# EasyEDA Pro project pcb.epro, board PCB17_1
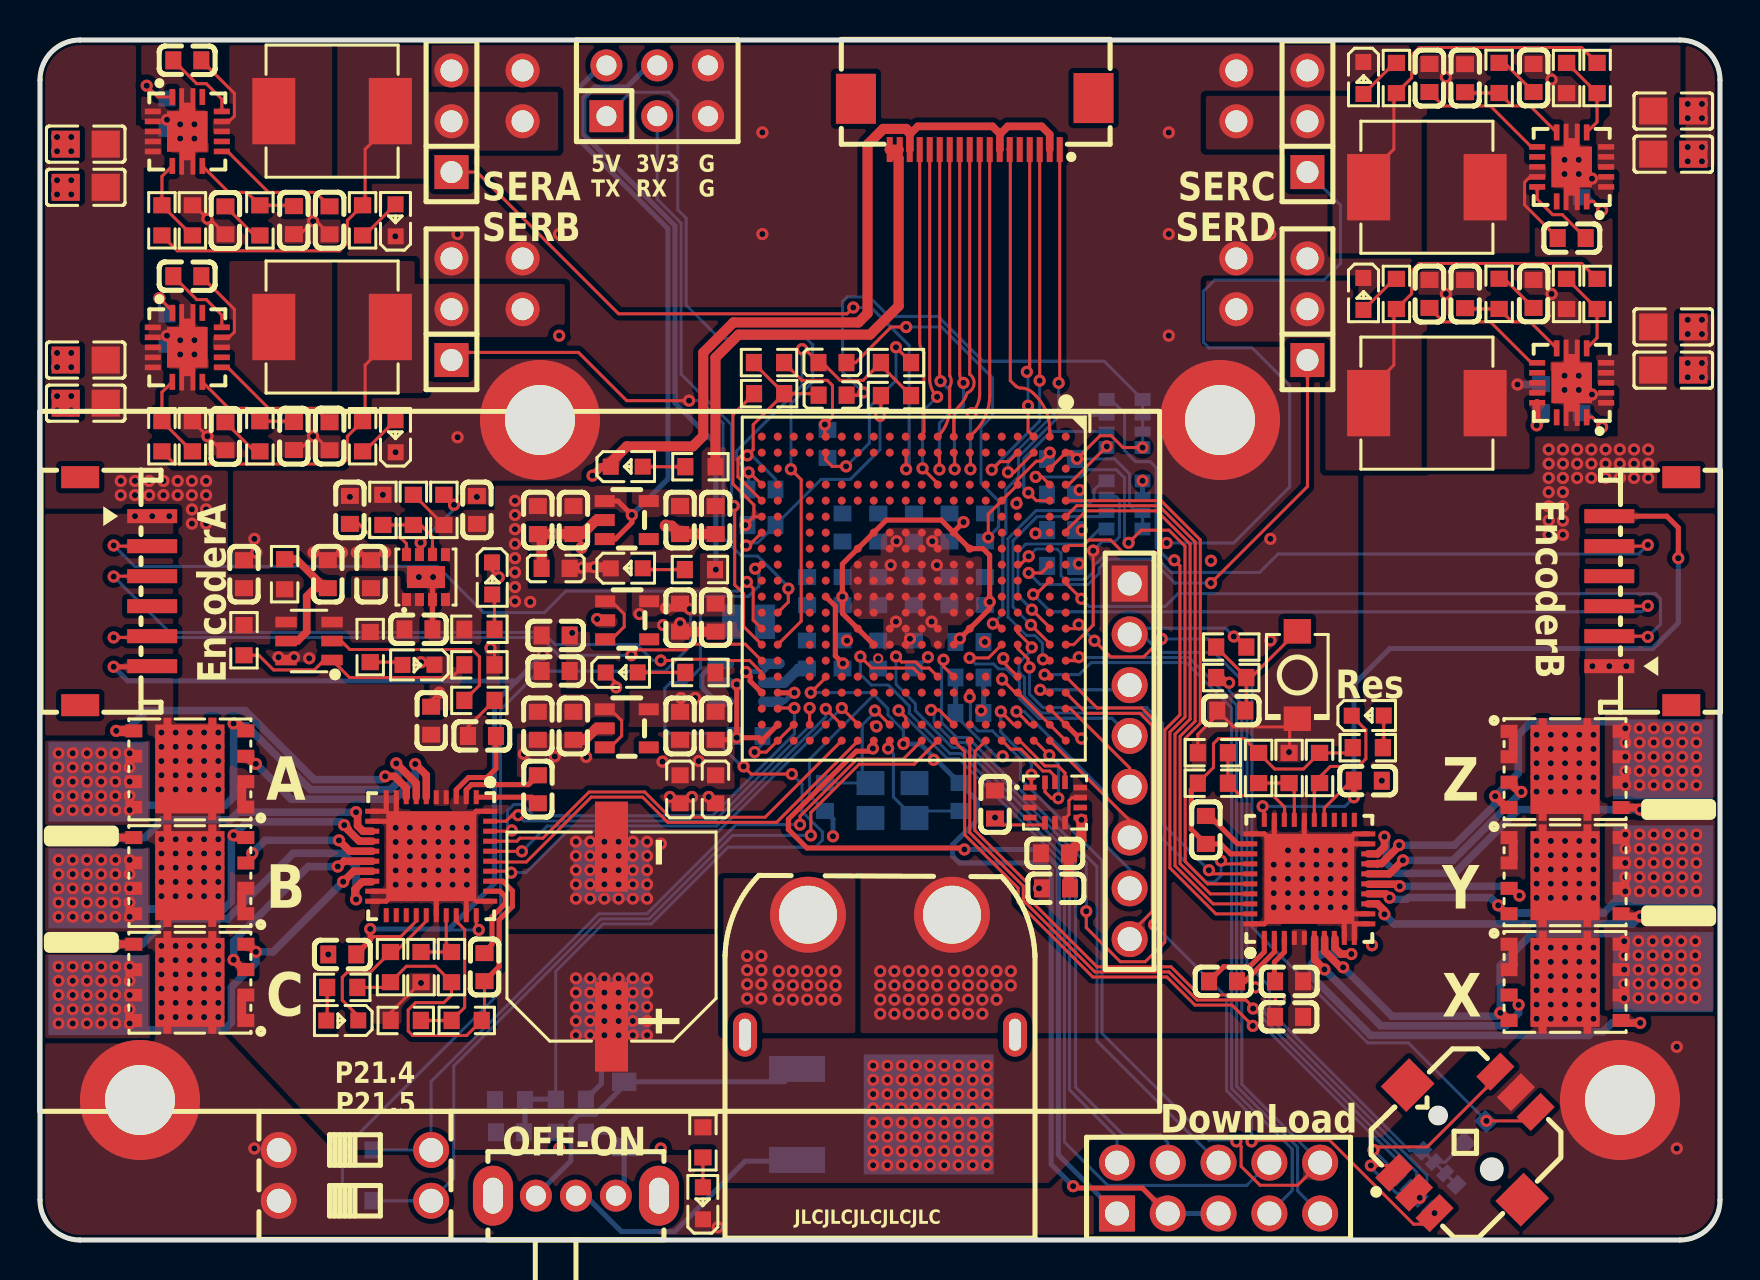
[diagram p5: board, top side]
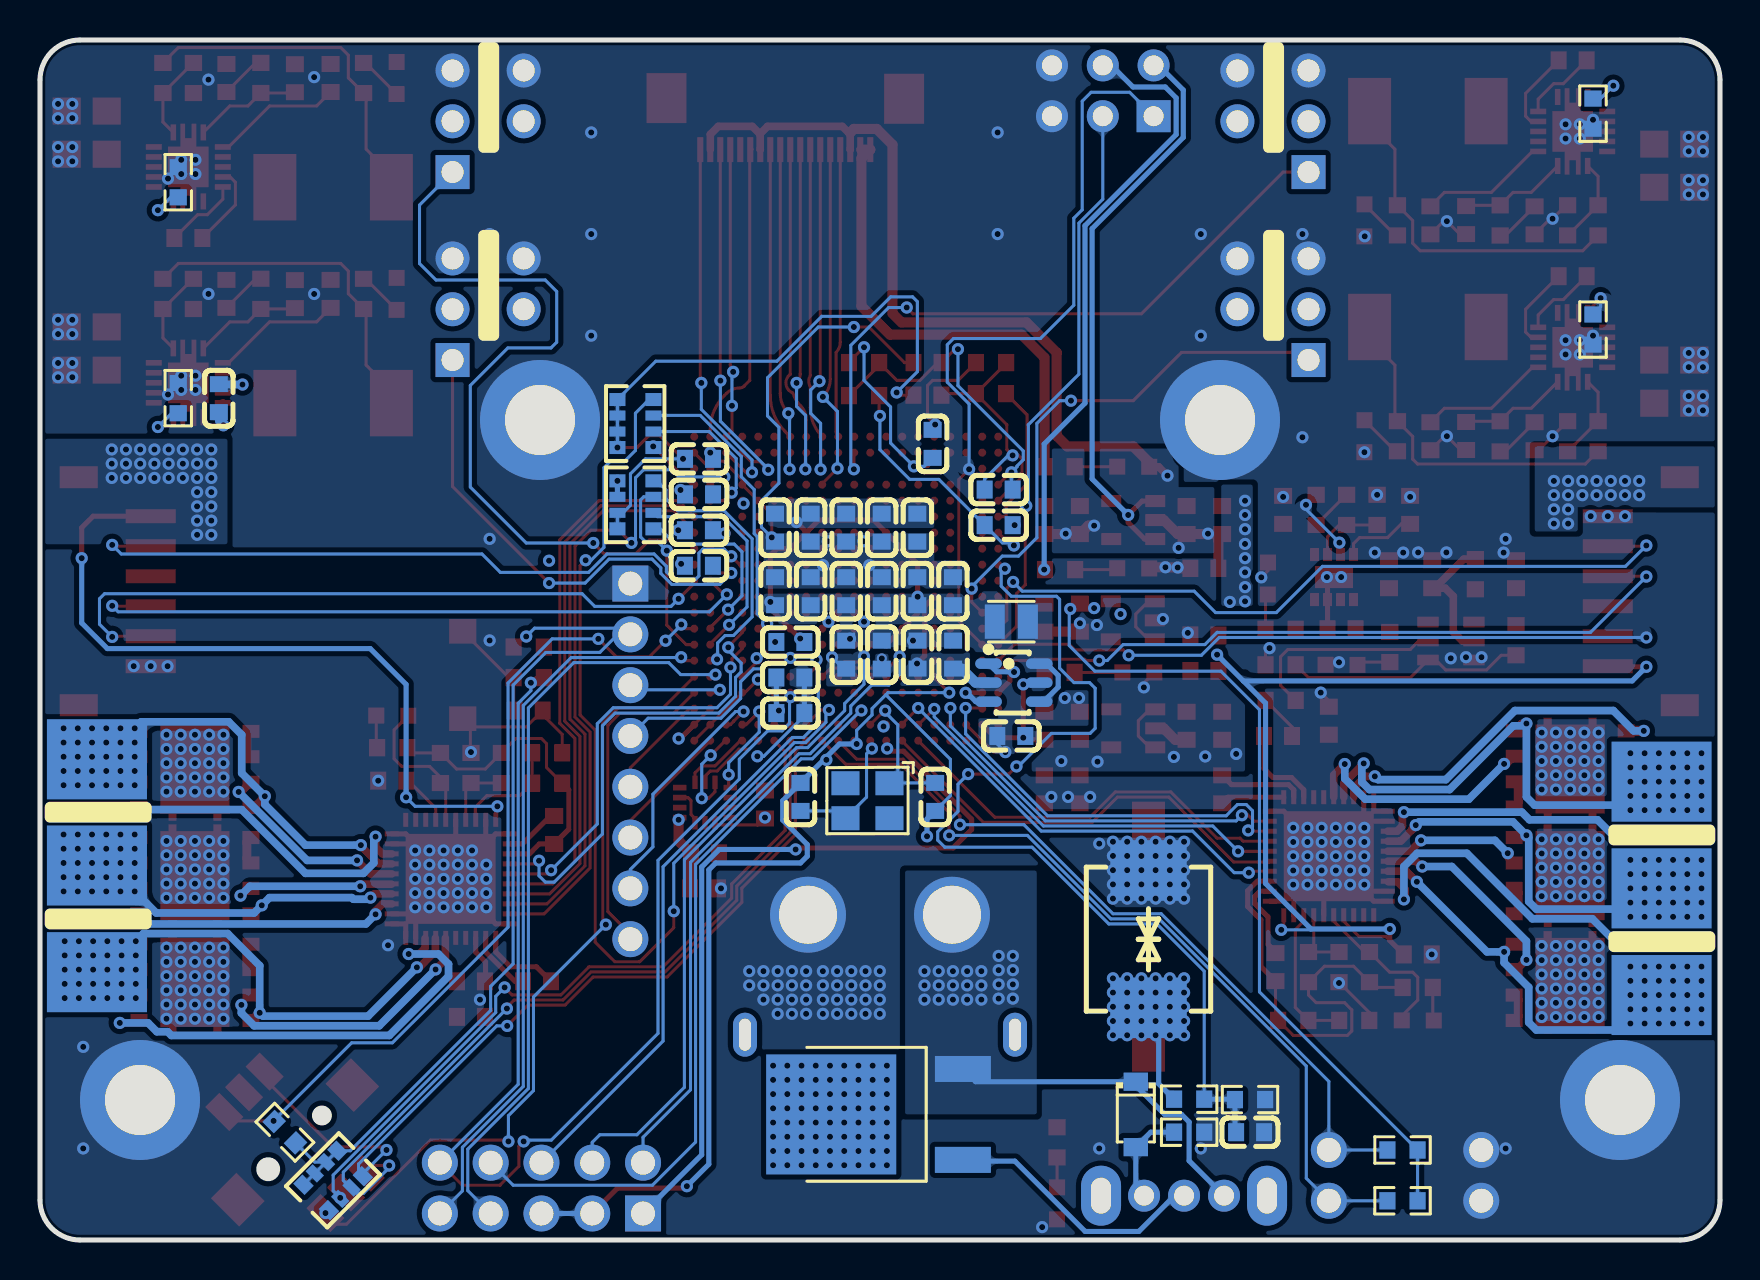
[diagram p6: board, bottom side, seen from below]

Outline 84 x 60 mm; copper layers: Top Layer, Inner1, Inner2, Bottom Layer. Coordinates in mm from the lower left corner of the outline.
Outline path: 0,58 0,2 arc(0.59,0.59) 2,0 82,0 arc(83.41,0.59) 84,2 84,58 arc(83.41,59.41) 82,60 2,60 arc(0.59,59.41) 0,58
Stack: Top Layer 0.035mm 外层铜厚1oz / Dielectric1 0.2104mm 7628 RC49% 8.6mil / Inner1 0.0152mm 内层铜厚 / Dielectric2 1.065mm 1.1mm H/HOZ Copper / Inner2 0.0152mm 内层铜厚 / Dielectric3 0.2104mm 7628 RC49% 8.6mil / Bottom Layer 0.035mm 外层铜厚1oz

## Design rules (mm)
net TMS: DP1
net TCK: DP1
template: 自定义配置
spacing copperThickness1oz (default): track to track 0.102, other pairs 0.152 to 0.3
spacing copperThickness2oz: track to track 0.203, other pairs 0.152 to 0.3
track width copperThickness1oz (default): min 0.127, default 0.254, max 2.54
track width copperThickness2oz: min 0.203, default 0.254, max 2.54
differential pair differentialPair (default): width min 0.127, default 0.254, max 2.54; gap min 0.152, default 0.152
via viaSize (default): diameter min 0.5, default 0.61, max 10; hole min 0.3, default 0.305, max 6.3

## Placement (name value [footprint] x y rotation side)
C1  100nF  [C0603]  40.12 29.27 90 bottom
C2  100nF  [C0603]  43.69 29.27 90 bottom
C3  100nF  [C0603]  38.34 29.27 90 bottom
C4  100nF  [C0603]  51.05 39.06 180 bottom
C5  100nF  [C0603]  51.05 37.28 180 bottom
C6  100nF  [C0603]  51.05 35.49 180 bottom
C7  100nF  [C0603]  41.91 29.27 90 bottom
C8  100nF  [C0603]  51.05 33.71 180 bottom
C9  2.2uF  [C0603]  46.48 26.34 180 bottom
C10  47uF  [C0603]  46.48 28.12 180 bottom
C11  100nF  [C0603]  59.56 26.47 0 top
C12  100nF  [C0603]  40.13 32.44 90 bottom
C13  100nF  [C0603]  41.91 32.44 90 bottom
C14  100nF  [C0603]  43.69 32.44 90 bottom
C15  100nF  [C0603]  45.47 32.44 90 bottom
C16  100nF  [C0603]  47.24 32.44 90 bottom
C17  22uF  [C0603]  35.43 25.2 0 bottom
C18  22uF  [C0603]  38.35 32.44 270 bottom
C19  100nF  [C0603]  46.48 29.9 0 bottom
C20  100nF  [C0603]  47.25 35.62 270 bottom
C21  15pF  [C0603]  45.97 22.15 270 bottom
C22  100nF  [C0603]  45.47 35.62 270 bottom
C23  100nF  [C0603]  43.69 35.62 270 bottom
C24  100nF  [C0603]  41.91 35.62 270 bottom
C25  100nF  [C0603]  40.13 35.62 270 bottom
C26  15pF  [C0603]  39.24 22.15 90 bottom
C27  100nF  [C0603]  36.07 37.52 180 bottom
C28  100nF  [C0603]  36.07 35.74 0 bottom
C29  100nF  [C0603]  39.37 39.81 270 bottom
C30  1uF  [C0603]  24.89 25.71 90 top
C31  100nF  [C0603]  26.67 25.71 90 top
C32  100nF  [C0603]  32 25.71 90 top
C33  1uF  [C0603]  33.78 25.71 90 top
C34  3.3nF  [C0603]  15.49 36.5 90 top
C35  1uF  [C0603]  25.78 28.45 180 top
C36  100nF  [C0603]  25.78 30.23 180 top
C37  1uF  [C0603]  24.89 36 90 top
C38  100nF  [C0603]  26.67 36 90 top
C39  100nF  [C0603]  32 31.12 90 top
C40  1uF  [C0603]  33.78 31.12 90 top
C41  100nF  [C0603]  32 36 90 top
C42  1uF  [C0603]  33.78 36 90 top
C43  10uF  [C0603]  18.92 30.54 180 top
C44  22uF  [C0603]  21.84 36.5 270 top
C45  470uF  [CAP-SMD_BD10.0-L10.3-W10.3-LS11.3-FD]  28.57 15.17 90 top
C46  1uF  [C0603]  16.55 33.29 270 top
C47  10uF  [C0603]  10.2 33.29 270 top
C48  1uF  [C0603]  14.39 33.29 270 top
C49  100nF  [C0603]  23.5 5.39 180 bottom
C50  10nF  [C0603]  47.75 21.77 270 top
C51  2.2uF  [C0603]  50.8 17.58 0 top
C52  100nF  [C0603]  50.75 19.33 0 top
C53  47nF  [C0603]  24.89 22.53 270 top
C54  47nF  [C0603]  59.15 12.93 180 top
C55  1uF  [C0603]  22.1 25.2 0 top
C56  1uF  [C0603]  62.45 12.93 180 top
C57  100nF  [C0603]  19.56 25.96 270 top
C58  100nF  [C0603]  62.45 11.16 0 top
C59  100nF  [C0603]  22.22 13.64 270 top
C60  100nF  [C0603]  58.29 20.5 270 top
C61  1uF  [C0603]  15.11 14.28 180 top
C62  1uF  [C0603]  66.39 22.97 0 top
C63  100nF  [C0603]  7.37 58.98 0 top
C64  100nF  [C0603]  7.37 48.19 0 top
C65  10uF  [C0805]  2.29 52.63 180 top
C66  10uF  [C0805]  2.29 41.84 180 top
C67  4.7uF  [C0805]  2.29 54.79 0 top
C68  22nF  [C0603]  14.48 50.98 270 top
C69  4.7uF  [C0805]  2.29 44 0 top
C70  22nF  [C0603]  14.48 40.19 270 top
C71  10pF  [C0603]  12.69 50.99 90 top
C72  10pF  [C0603]  12.69 40.2 90 top
C73  10nF  [C0603]  9.27 50.98 90 top
C74  10nF  [C0603]  9.27 40.19 90 top
C75  100nF  [C0603]  76.58 50.1 180 top
C76  100nF  [C0603]  75.06 42.09 90 bottom
C77  10uF  [C0805]  81.66 56.45 0 top
C78  10uF  [C0805]  81.66 45.65 0 top
C79  4.7uF  [C0805]  81.66 54.29 180 top
C80  22nF  [C0603]  69.47 58.1 90 top
C81  4.7uF  [C0805]  81.66 43.49 180 top
C82  22nF  [C0603]  69.47 47.3 90 top
C83  10pF  [C0603]  71.25 58.09 270 top
C84  10pF  [C0603]  71.25 47.29 270 top
C85  10nF  [C0603]  74.68 58.1 270 top
C86  10nF  [C0603]  74.68 47.3 270 top
CN1  XT60PW-M  [CONN-TH_XT60PW-M]  42 13.26 90 top
CN2  HX15001-6AWB  [CONN-SMD_HX15001-6AWB]  3.81 32.44 270 top
CN3  HX15001-6AWB  [CONN-SMD_HX15001-6AWB]  80.26 32.44 90 top
D1  BZT52C16  [SOD-123_L2.7-W1.6-LS3.7-RD]  29.21 6.28 270 bottom
D3  SMDJ15CA  [SMC_L6.9-W5.9-LS7.9-BI]  28.57 15.04 270 bottom
FPC1  FPC-05F-18PH20  [FPC-SMD_18P-P0.50_FPC-05F-18PH20]  46.74 55.81 180 top
H1  PZ2.54-2*5  [HDR-TH_10P-P2.54-V-M-R2-C5-S2.54-1]  58.93 2.6 0 top
H2  PZ254V-11-03P  [HDR-TH_3P-P2.54-V-M]  20.57 55.94 90 top
H3  PZ254V-11-03P  [HDR-TH_3P-P2.54-V-M]  20.57 46.54 90 top
H4  PZ254V-11-03P  [HDR-TH_3P-P2.54-V-M]  63.37 55.94 90 top
H5  PZ254V-11-03P  [HDR-TH_3P-P2.54-V-M]  63.37 46.54 90 top
L1  4.7uH  [IND-SMD_L2.0-W1.6]  35.43 30.92 180 bottom
L2  MGGB1608M501HT-LF  [L0603]  39.63 42.24 0 top
L3  MGGB1608M501HT-LF  [L0603]  39.62 43.87 0 top
L4  CBG160808U000T  [L0603]  32 22.53 90 top
L5  CBG160808U000T  [L0603]  33.78 22.53 90 top
L6  CBG160808U000T  [L0603]  25.78 33.58 180 top
L7  3.3uH  [IND-SMD_L7.1-W6.6]  14.61 56.44 0 top
L8  3.3uH  [IND-SMD_L7.1-W6.6]  14.61 45.65 0 top
L9  3.3uH  [IND-SMD_L7.1-W6.6]  69.34 52.64 180 top
L10  3.3uH  [IND-SMD_L7.1-W6.6]  69.34 41.84 180 top
LED1  NCD0603R1  [LED0603-RD_RED]  29.08 28.38 0 top
LED2  NCD0603R1  [LED0603-RD_RED]  22.61 33.08 270 top
LED3  NCD0603R1  [LED0603-RD_RED]  29.34 33.58 0 top
LED4  NCD0603R1  [LED0603-RD_RED]  29.34 38.66 0 top
LED5  NCD0603R1  [LED0603-RD_RED]  33.15 1.83 90 top
LED6  NCD0603R1  [LED0603-RD_RED]  18.92 28.76 180 top
LED7  NCD0603R1  [LED0603-RD_RED]  66.39 26.22 0 top
LED8  NCD0603R1  [LED0603-RD_RED]  15.11 10.98 180 top
LED9  NCD0603R1  [LED0603-RD_RED]  17.78 50.98 90 top
LED10  NCD0603R1  [LED0603-RD_RED]  17.78 40.19 90 top
LED11  NCD0603R1  [LED0603-RD_RED]  66.17 58.1 270 top
LED12  NCD0603R1  [LED0603-RD_RED]  66.17 47.3 270 top
NOREF  -  [Pad_e382]  81.15 13.39 180 top
NOREF#2  -  [Pad_e438]  59.82 46.54 180 top
NOREF#3  -  [Pad_e380]  81.15 24.03 180 top
NOREF#4  -  [Pad_e1123]  2.92 17.58 0 top
NOREF#5  -  [Pad_e437]  59.82 49.08 180 top
NOREF#6  -  [Pad_e424]  24.13 46.54 0 top
NOREF#7  -  [Pad_e1124]  2.92 12.25 0 top
NOREF#8  -  [Pad_e1122]  2.92 22.92 0 top
NOREF#9  -  [Pad_e421]  24.13 58.48 0 top
NOREF#10  -  [Pad_e425]  24.13 49.08 0 top
NOREF#11  -  [Pad_e434]  59.82 58.48 180 top
NOREF#12  -  [Pad_e423]  24.13 55.94 0 top
NOREF#13  -  [Pad_e381]  81.15 18.72 180 top
NOREF#14  -  [Pad_e436]  59.82 55.94 180 top
P1  2.54-1*8P母环保  [HDR-TH_8P-P2.54-V-F-1]  54.48 23.93 270 top
Q1  BSL215CH6327  [TSOP-6_L3.0-W1.5-P0.95-LS2.8-BL]  35.31 27.87 270 bottom
Q2  HY19P03D  [TO-252-2_L6.6-W6.1-P4.57-LS9.9-TL-CW]  41.15 6.28 0 bottom
Q3  CSD87350Q5D  [LSON-8_L6.0-W5.0-P1.27-LS6.0-TL-EP]  7.49 23.55 180 top
Q4  CSD87350Q5D  [LSON-8_L6.0-W5.0-P1.27-LS6.0-TL-EP]  76.25 12.88 0 top
Q5  CSD87350Q5D  [LSON-8_L6.0-W5.0-P1.27-LS6.0-TL-EP]  7.49 18.22 180 top
Q6  CSD87350Q5D  [LSON-8_L6.0-W5.0-P1.27-LS6.0-TL-EP]  76.25 18.22 0 top
Q7  CSD87350Q5D  [LSON-8_L6.0-W5.0-P1.27-LS6.0-TL-EP]  7.49 12.88 180 top
Q8  CSD87350Q5D  [LSON-8_L6.0-W5.0-P1.27-LS6.0-TL-EP]  76.25 23.53 0 top
R1  10K  [R0603]  59.56 29.65 0 top
R2  500  [R0603]  59.56 28.12 0 top
R3  0  [R0603]  36.46 42.32 0 top
R4  0  [R0603]  36.45 43.87 180 top
R5  0  [R0603]  42.8 42.22 0 top
R6  0  [R0603]  42.8 43.87 180 top
R7  4K7  [R0603]  33.02 28.38 180 top
R8  51K  [R0603]  18.67 36.5 90 top
R9  10K  [R0603]  17.14 36.5 90 top
R10  4.7kΩ  [R0603]  21.97 30.54 0 top
R11  100K  [R0603]  20.19 36.5 270 top
R12  4.7kΩ  [R0603]  33 33.52 180 top
R13  4.7kΩ  [R0603]  33.02 38.66 180 top
R14  10K  [R0603]  33.15 4.88 90 top
R15  20K  [R0603]  10.2 29.99 90 top
R16  2K  [R0603]  21.97 28.76 180 top
R17  10kΩ  [R0603]  16.51 29.65 90 top
R18  1M  [R0603]  21.97 26.98 180 top
R19  100  [R0603]  12.23 33.29 90 top
R20  10K  [R0603]  26.54 5.39 0 bottom
R21  300K  [R0603]  26.54 7.04 0 bottom
R22  51K  [R0603]  23.5 7.02 0 bottom
R23  10K  [R0603]  71.75 5.39 225 bottom
R24  4.7kΩ  [R0603]  15.88 1.96 0 bottom
R25  4.7kΩ  [R0603]  15.88 4.5 0 bottom
R26  10K  [R0603]  17.53 13.64 90 top
R27  10K  [R0603]  63.98 23.6 270 top
R28  10K  [R0603]  15.11 12.63 0 top
R29  10K  [R0603]  66.39 24.62 180 top
R30  75K  [R0603]  21.34 10.98 0 top
R31  75K  [R0603]  58.64 22.84 180 top
R32  75K  [R0603]  18.29 10.98 180 top
R33  75K  [R0603]  58.64 24.36 180 top
R34  0  [R0603]  20.57 13.64 270 top
R35  0  [R0603]  60.93 23.6 90 top
R36  75K  [R0603]  19.05 13.64 270 top
R37  75K  [R0603]  62.45 23.6 90 top
R38  100K  [R0603]  6.35 56.32 90 bottom
R39  100K  [R0603]  6.35 45.52 90 bottom
R40  51K  [R0603]  6.1 50.98 270 top
R41  10K  [R0603]  16.13 50.98 90 top
R42  51K  [R0603]  6.1 40.19 270 top
R43  10K  [R0603]  16.13 40.19 90 top
R44  10K  [R0603]  10.99 50.98 90 top
R45  4K7  [R0603]  7.62 50.98 270 top
R46  10K  [R0603]  10.99 40.18 90 top
R47  4K7  [R0603]  7.62 40.19 270 top
R48  100K  [R0603]  77.09 52.89 270 bottom
R49  100K  [R0603]  77.09 42.09 270 bottom
R50  51K  [R0603]  77.85 58.1 90 top
R51  10K  [R0603]  67.82 58.1 270 top
R52  51K  [R0603]  77.85 47.3 90 top
R53  10K  [R0603]  67.82 47.3 270 top
R54  10K  [R0603]  72.96 58.1 270 top
R55  4K7  [R0603]  76.33 58.1 90 top
R56  10K  [R0603]  72.96 47.31 270 top
R57  4K7  [R0603]  76.33 47.3 90 top
RN1  10K  [RES-ARRAY-SMD_0603-8P-L3.2-W1.6-BL]  54.23 36.76 90 bottom
RN2  10K  [RES-ARRAY-SMD_0603-8P-L3.2-W1.6-BL]  54.23 40.82 90 bottom
RN3  10kΩ  [RES-ARRAY-SMD_0603-8P-L3.2-W1.6-BL]  69.34 2.98 135 bottom
SW1  TS-1088-AR02016  [SW-SMD_L3.9-W3.0-P4.45]  62.87 28.25 270 top
SW2  SK12D07VG5  [SW-TH_SK12D07VG5]  26.8 2.22 0 top
SW3  DSWB02LHGET  [SW-TH_DSWB02LHGET]  15.75 3.23 270 top
SW4  TM-4175-B-A  [SW-SMD_TM-4175-B-X]  71.25 4.88 45 top
U1  TLV75733PDBVR  [SOT-23-5_L2.9-W1.6-P0.95-LS2.8-BL]  29.34 25.58 270 top
U2  TPS82130SILR  [USIP-8_L3.0-W2.8-P0.65-TL-EP]  19.3 33.15 90 top
U3  RT9013-33GB  [SOT-23-5_L2.9-W1.6-P0.95-LS2.8-BR]  29.36 30.98 180 top
U4  RT9013-33GB  [SOT-23-5_L2.9-W1.6-P0.95-LS2.8-BR]  29.34 36 180 top
U5  ETA7014S2G  [SOT-23-6_L2.9-W1.6-P0.95-LS2.8-BL]  13.45 29.95 90 top
U6  ICM-42688-P  [LGA-14_L3.0-W2.5-P0.50-TL]  50.75 21.87 0 top
U7  2541FV-2x3P  [HDR-TH_6P-P2.54-V-F-R2-C3-S2.54]  30.86 57.46 0 top
U8  DRV8323HRTAR  [M3螺丝孔]  25 41 0 top
U9  DRV8323HRTAR  [M3螺丝孔]  59 41 0 top
U10  TPS54821RHLR  [M3螺丝孔]  5 7 0 top
U11  TPS54821RHLR  [M3螺丝孔]  79 7 0 top
U12  TPS54821RHLR  [QFN-40_L6.0-W6.0-P0.50-BL-EP4.5]  19.56 19.19 180 top
U13  TPS54821RHLR  [QFN-40_L6.0-W6.0-P0.50-BL-EP4.5]  63.47 18.06 0 top
U14  SAK-TC377TP-96F300S AA  [VQFN-14_L3.5-W3.5-P0.50-TL-EP_TPS54622RHLT]  7.37 55.43 0 top
U15  TPS54821RHLR  [VQFN-14_L3.5-W3.5-P0.50-TL-EP_TPS54622RHLT]  7.37 44.63 0 top
U16  TPS54821RHLR  [VQFN-14_L3.5-W3.5-P0.50-TL-EP_TPS54622RHLT]  76.58 53.65 180 top
U17  TPS54821RHLR  [VQFN-14_L3.5-W3.5-P0.50-TL-EP_TPS54622RHLT]  76.58 42.86 180 top
U18  SAK-TC377TP-96F300S AA  [PG-LFBGA-292_L17.0-W17.0-BL_SAK-TC1791F]  43.69 32.57 180 top
X1  20MHz  [OSC-SMD_4P-L3.2-W2.5-BL]  42.63 21.96 0 bottom

## Footprints (pads in the part's own frame, mm; a bottom-side part is the same pattern mirrored in y, then rotated)
C0603
  rect 0.8x0.9 smd: 1(-0.7,0) 2(0.7,0)
C0805
  rect 1.41x1.35 smd: 1(-1,0) 2(1,0)
CAP-SMD_BD10.0-L10.3-W10.3-LS11.3-FD
  rect 4.5x1.65 smd: 1(-4.5,0) 2(4.5,0)
CONN-SMD_HX15001-6AWB
  rect 0.7x2.5 smd: 1(-3.75,1.8) 2(-2.25,1.8) 3(-0.75,1.8) 4(0.75,1.8) 5(2.25,1.8) 6(3.75,1.8)
  rect 1.1x1.9 smd: 7(5.7,-1.8) 8(-5.7,-1.8)
CONN-TH_XT60PW-M
  round 3.8 hole 2.9: 1(3,-3.6) 2(3,3.6)
  oval 2.2x1.2 hole 1.6x0.6: 3(-3,6.75) 4(-3,-6.75)
FPC-SMD_18P-P0.50_FPC-05F-18PH20
  rect 0.3x1.25 smd: 1(-4.25,1.288) 2(-3.75,1.288) 3(-3.25,1.288) 4(-2.75,1.288) 5(-2.25,1.288) 6(-1.75,1.288) 7(-1.25,1.288) 8(-0.75,1.288) 9(-0.25,1.288) 10(0.25,1.288) 11(0.75,1.288) 12(1.25,1.288) 13(1.75,1.288) 14(2.25,1.288) 15(2.75,1.288) 16(3.25,1.288) 17(3.75,1.288) 18(4.25,1.288)
  rect 2x2.5 smd: 19(-5.94,-1.288) 20(5.94,-1.252)
HDR-TH_3P-P2.54-V-M
  rect 1.7x1.7 hole 1.1: 1(-2.54,0)
  round 1.7 hole 1.1: 2(0,0) 3(2.54,0)
HDR-TH_6P-P2.54-V-F-R2-C3-S2.54
  rect 1.7x1.6 hole 1: 1(-2.54,-1.27)
  round 1.6 hole 1: 2(-2.54,1.27) 3(0,-1.27) 4(0,1.27) 5(2.54,-1.27) 6(2.54,1.27)
HDR-TH_8P-P2.54-V-F-1
  rect 1.8x1.8 hole 1.2: 1(-8.89,0)
  round 1.8 hole 1.2: 2(-6.35,0) 3(-3.81,0) 4(-1.27,0) 5(1.27,0) 6(3.81,0) 7(6.35,0) 8(8.89,0)
HDR-TH_10P-P2.54-V-M-R2-C5-S2.54-1
  rect 1.8x1.8 hole 1.2: 1(-5.08,-1.27)
  round 1.8 hole 1.2: 2(-5.08,1.27) 3(-2.54,-1.27) 4(-2.54,1.27) 5(0,-1.27) 6(0,1.27) 7(2.54,-1.27) 8(2.54,1.27) 9(5.08,-1.27) 10(5.08,1.27)
IND-SMD_L2.0-W1.6
  rect 1x1.72 smd: 1(0.828,0) 2(-0.828,0)
IND-SMD_L7.1-W6.6
  rect 2.15x3.32 smd: 1(-2.913,0) 2(2.913,0)
L0603
  rect 0.8x0.864 smd: 1(-0.7,0) 2(0.7,0)
LED0603-RD_RED
  rect 0.8x0.8 smd: 1(-0.799,-0.004) 2(0.799,0.004)
LGA-14_L3.0-W2.5-P0.50-TL
  rect 0.675x0.28 smd: 1(-1.262,0.75) 2(-1.262,0.25) 3(-1.262,-0.25) 4(-1.262,-0.75) 8(1.262,-0.75) 9(1.262,-0.25) 10(1.262,0.25) 11(1.262,0.75)
  rect 0.28x0.675 smd: 5(-0.5,-1.012) 6(0,-1.012) 7(0.5,-1.012) 12(0.5,1.012) 13(0,1.012) 14(-0.5,1.012)
LSON-8_L6.0-W5.0-P1.27-LS6.0-TL-EP
  rect 0.85x0.65 smd: 1(-2.8,1.905) 2(-2.8,0.635) 3(-2.8,-0.635) 4(-2.8,-1.905) 5(2.8,-1.905) 6(2.8,-0.635) 7(2.8,0.635) 8(2.8,1.905)
  rect 0.45x1 smd: 1(-2.594,1.27)
  custom 3.46x5.13 smd: 9(0,0)
M3螺丝孔
  round 6 hole 3.5: 1(0,0)
OSC-SMD_4P-L3.2-W2.5-BL
  rect 1.4x1.2 smd: 1(-1.1,-0.875) 2(1.1,-0.875) 3(1.1,0.875) 4(-1.1,0.875)
Pad_e380
  rect 5x4 smd far side: 1(0,0)
Pad_e381
  rect 5x4 smd far side: 1(0,0)
Pad_e382
  rect 5x4 smd far side: 1(0,0)
Pad_e421
  round 1.7 hole 1.1: 1(0,0)
Pad_e423
  round 1.7 hole 1.1: 1(0,0)
Pad_e424
  round 1.7 hole 1.1: 1(0,0)
Pad_e425
  round 1.7 hole 1.1: 1(0,0)
Pad_e434
  round 1.7 hole 1.1: 1(0,0)
Pad_e436
  round 1.7 hole 1.1: 1(0,0)
Pad_e437
  round 1.7 hole 1.1: 1(0,0)
Pad_e438
  round 1.7 hole 1.1: 1(0,0)
Pad_e1122
  rect 5x4 smd far side: 1(0,0)
Pad_e1123
  rect 5x4 smd far side: 1(0,0)
Pad_e1124
  rect 5x4 smd far side: 1(0,0)
PG-LFBGA-292_L17.0-W17.0-BL_SAK-TC1791F
  round 0.4 smd: A1(-7.6,-7.6) A2(-7.6,-6.8) A3(-7.6,-6) A4(-7.6,-5.2) A5(-7.6,-4.4) A6(-7.6,-3.6) A7(-7.6,-2.8) A8(-7.6,-2) A9(-7.6,-1.2) A10(-7.6,-0.4) A11(-7.6,0.4) A12(-7.6,1.2) A13(-7.6,2) A14(-7.6,2.8) A15(-7.6,3.6) A16(-7.6,4.4) A17(-7.6,5.2) A18(-7.6,6) A19(-7.6,6.8) A20(-7.6,7.6) B1(-6.8,-7.6) B2(-6.8,-6.8) B3(-6.8,-6) B4(-6.8,-5.2) B5(-6.8,-4.4) B6(-6.8,-3.6) B7(-6.8,-2.8) B8(-6.8,-2) B9(-6.8,-1.2) B10(-6.8,-0.4) B11(-6.8,0.4) B12(-6.8,1.2) B13(-6.8,2) B14(-6.8,2.8) B15(-6.8,3.6) B16(-6.8,4.4) B17(-6.8,5.2) B18(-6.8,6) B19(-6.8,6.8) B20(-6.8,7.6) C1(-6,-7.6) C2(-6,-6.8) C19(-6,6.8) C20(-6,7.6) D1(-5.2,-7.6) D2(-5.2,-6.8) D4(-5.2,-5.2) D5(-5.2,-4.4) D6(-5.2,-3.6) D7(-5.2,-2.8) D8(-5.2,-2) D9(-5.2,-1.2) D10(-5.2,-0.4) D11(-5.2,0.4) D12(-5.2,1.2) D13(-5.2,2) D14(-5.2,2.8) D15(-5.2,3.6) D16(-5.2,4.4) D17(-5.2,5.2) D19(-5.2,6.8) D20(-5.2,7.6) E1(-4.4,-7.6) E2(-4.4,-6.8) E4(-4.4,-5.2) E5(-4.4,-4.4) E6(-4.4,-3.6) E7(-4.4,-2.8) E8(-4.4,-2) E9(-4.4,-1.2) E10(-4.4,-0.4) E11(-4.4,0.4) E12(-4.4,1.2) E13(-4.4,2) E14(-4.4,2.8) E15(-4.4,3.6) E16(-4.4,4.4) E17(-4.4,5.2) E19(-4.4,6.8) E20(-4.4,7.6) F1(-3.6,-7.6) F2(-3.6,-6.8) F4(-3.6,-5.2) F5(-3.6,-4.4) F16(-3.6,4.4) F17(-3.6,5.2) F19(-3.6,6.8) F20(-3.6,7.6) G1(-2.8,-7.6) G2(-2.8,-6.8) G4(-2.8,-5.2) G5(-2.8,-4.4) G8(-2.8,-2) G9(-2.8,-1.2) G10(-2.8,-0.4) G11(-2.8,0.4) G12(-2.8,1.2) G13(-2.8,2) G16(-2.8,4.4) G17(-2.8,5.2) G19(-2.8,6.8) G20(-2.8,7.6) H1(-2,-7.6) H2(-2,-6.8) H4(-2,-5.2) H5(-2,-4.4) H7(-2,-2.8) H9(-2,-1.2) H10(-2,-0.4) H11(-2,0.4) H12(-2,1.2) H14(-2,2.8) H16(-2,4.4) H17(-2,5.2) H19(-2,6.8) H20(-2,7.6) J1(-1.2,-7.6) J2(-1.2,-6.8) J4(-1.2,-5.2) J5(-1.2,-4.4) J7(-1.2,-2.8) J8(-1.2,-2) J10(-1.2,-0.4) J11(-1.2,0.4) J13(-1.2,2) J14(-1.2,2.8) J16(-1.2,4.4) J17(-1.2,5.2) J19(-1.2,6.8) J20(-1.2,7.6) K1(-0.4,-7.6) K2(-0.4,-6.8) K4(-0.4,-5.2) K5(-0.4,-4.4) K7(-0.4,-2.8) K8(-0.4,-2) K9(-0.4,-1.2) K10(-0.4,-0.4) K11(-0.4,0.4) K12(-0.4,1.2) K13(-0.4,2) K14(-0.4,2.8) K16(-0.4,4.4) K17(-0.4,5.2) K19(-0.4,6.8) K20(-0.4,7.6) L1(0.4,-7.6) L2(0.4,-6.8) L4(0.4,-5.2) L5(0.4,-4.4) L7(0.4,-2.8) L8(0.4,-2) L9(0.4,-1.2) L10(0.4,-0.4) L11(0.4,0.4) L12(0.4,1.2) L13(0.4,2) L14(0.4,2.8) L16(0.4,4.4) L17(0.4,5.2) L19(0.4,6.8) L20(0.4,7.6) M1(1.2,-7.6) M2(1.2,-6.8) M4(1.2,-5.2) M5(1.2,-4.4) M7(1.2,-2.8) M8(1.2,-2) M10(1.2,-0.4) M11(1.2,0.4) M13(1.2,2) M14(1.2,2.8) M16(1.2,4.4) M17(1.2,5.2) M19(1.2,6.8) M20(1.2,7.6) N1(2,-7.6) N2(2,-6.8) N4(2,-5.2) N5(2,-4.4) N7(2,-2.8) N9(2,-1.2) N10(2,-0.4) N11(2,0.4) N12(2,1.2) N14(2,2.8) N16(2,4.4) N17(2,5.2) N19(2,6.8) N20(2,7.6) P1(2.8,-7.6) P2(2.8,-6.8) P4(2.8,-5.2) P5(2.8,-4.4) P8(2.8,-2) P9(2.8,-1.2) P10(2.8,-0.4) P11(2.8,0.4) P12(2.8,1.2) P13(2.8,2) P16(2.8,4.4) P17(2.8,5.2) P19(2.8,6.8) P20(2.8,7.6) R1(3.6,-7.6) R2(3.6,-6.8) R4(3.6,-5.2) R5(3.6,-4.4) R16(3.6,4.4) R17(3.6,5.2) R19(3.6,6.8) R20(3.6,7.6) T1(4.4,-7.6) T2(4.4,-6.8) T4(4.4,-5.2) T5(4.4,-4.4) T6(4.4,-3.6) T7(4.4,-2.8) T8(4.4,-2) T9(4.4,-1.2) T10(4.4,-0.4) T11(4.4,0.4) T12(4.4,1.2) T13(4.4,2) T14(4.4,2.8) T15(4.4,3.6) T16(4.4,4.4) T17(4.4,5.2) T19(4.4,6.8) T20(4.4,7.6) U1(5.2,-7.6) U2(5.2,-6.8) U4(5.2,-5.2) U5(5.2,-4.4) U6(5.2,-3.6) U7(5.2,-2.8) U8(5.2,-2) U9(5.2,-1.2) U10(5.2,-0.4) U11(5.2,0.4) U12(5.2,1.2) U13(5.2,2) U14(5.2,2.8) U15(5.2,3.6) U16(5.2,4.4) U17(5.2,5.2) U19(5.2,6.8) U20(5.2,7.6) V1(6,-7.6) V2(6,-6.8) V19(6,6.8) V20(6,7.6) W1(6.8,-7.6) W2(6.8,-6.8) W3(6.8,-6) W4(6.8,-5.2) W5(6.8,-4.4) W6(6.8,-3.6) W7(6.8,-2.8) W8(6.8,-2) W9(6.8,-1.2) W10(6.8,-0.4) W11(6.8,0.4) W12(6.8,1.2) W13(6.8,2) W14(6.8,2.8) W15(6.8,3.6) W16(6.8,4.4) W17(6.8,5.2) W18(6.8,6) W19(6.8,6.8) W20(6.8,7.6) Y1(7.6,-7.6) Y2(7.6,-6.8) Y3(7.6,-6) Y4(7.6,-5.2) Y5(7.6,-4.4) Y6(7.6,-3.6) Y7(7.6,-2.8) Y8(7.6,-2) Y9(7.6,-1.2) Y10(7.6,-0.4) Y11(7.6,0.4) Y12(7.6,1.2) Y13(7.6,2) Y14(7.6,2.8) Y15(7.6,3.6) Y16(7.6,4.4) Y17(7.6,5.2) Y18(7.6,6) Y19(7.6,6.8) Y20(7.6,7.6)
QFN-40_L6.0-W6.0-P0.50-BL-EP4.5
  rect 0.25x0.7 smd: 1(-2.25,-2.95) 2(-1.75,-2.95) 3(-1.25,-2.95) 4(-0.75,-2.95) 5(-0.25,-2.95) 6(0.25,-2.95) 7(0.75,-2.95) 8(1.25,-2.95) 9(1.75,-2.95) 10(2.25,-2.95) 21(2.25,2.95) 22(1.75,2.95) 23(1.25,2.95) 24(0.75,2.95) 25(0.25,2.95) 26(-0.25,2.95) 27(-0.75,2.95) 28(-1.25,2.95) 29(-1.75,2.95) 30(-2.25,2.95)
  rect 0.7x0.25 smd: 11(2.95,-2.25) 12(2.95,-1.75) 13(2.95,-1.25) 14(2.95,-0.75) 15(2.95,-0.25) 16(2.95,0.25) 17(2.95,0.75) 18(2.95,1.25) 19(2.95,1.75) 20(2.95,2.25) 31(-2.95,2.25) 32(-2.95,1.75) 33(-2.95,1.25) 34(-2.95,0.75) 35(-2.95,0.25) 36(-2.95,-0.25) 37(-2.95,-0.75) 38(-2.95,-1.25) 39(-2.95,-1.75) 40(-2.95,-2.25)
  rect 4.5x4.5 smd: 41(0,0)
R0603
  rect 0.806x0.864 smd: 1(-0.753,0) 2(0.753,0)
RES-ARRAY-SMD_0603-8P-L3.2-W1.6-BL
  rect 0.65x0.8 smd: 1(-1.2,-0.9) 4(1.2,-0.9) 5(1.2,0.9) 8(-1.2,0.9)
  rect 0.5x0.8 smd: 2(-0.4,-0.9) 3(0.4,-0.9) 6(0.4,0.9) 7(-0.4,0.9)
SMC_L6.9-W5.9-LS7.9-BI
  rect 3.03x3.82 smd: 1(-3.435,0) 2(3.435,0)
SOD-123_L2.7-W1.6-LS3.7-RD
  rect 0.91x1.22 smd: 1(-1.635,0) 2(1.635,0)
SOT-23-5_L2.9-W1.6-P0.95-LS2.8-BL
  rect 0.6x1 smd: 1(-0.95,-1.1) 2(0,-1.1) 3(0.95,-1.1) 4(0.95,1.1) 5(-0.95,1.1)
SOT-23-5_L2.9-W1.6-P0.95-LS2.8-BR
  rect 1x0.6 smd: 1(1.1,-0.95) 2(1.1,0) 3(1.1,0.95) 4(-1.1,0.95) 5(-1.1,-0.95)
SOT-23-6_L2.9-W1.6-P0.95-LS2.8-BL
  rect 0.532x1.072 smd: 1(-0.95,-1.149) 2(0,-1.149) 3(0.95,-1.149) 4(0.95,1.149) 5(0,1.149) 6(-0.95,1.149)
SW-SMD_L3.9-W3.0-P4.45
  rect 1.23x1.36 smd: 1(-2.185,0) 2(2.185,0)
SW-SMD_TM-4175-B-X
  rect 1.7x1 smd: 1(-3.575,1.425) 2(-3.575,0.028) 3(-3.575,-1.425) 4(3.575,1.425) 5(3.575,-0.028) 6(3.575,-1.425)
  rect 2x1.8 smd: 7(0,4.05) 7(0,-4.05)
SW-TH_DSWB02LHGET
  round 1.8 hole 1.2: 1(-1.27,3.81) 2(1.27,3.81) 3(-1.27,-3.81) 4(1.27,-3.81)
SW-TH_SK12D07VG5
  oval 1.6x1.6 hole 1: 1(-2,0) 2(0,0) 3(2,0)
  oval 2x3 hole 1x1.8: 4(4.15,0) 5(-4.15,0)
TO-252-2_L6.6-W6.1-P4.57-LS9.9-TL-CW
  rect 2.8x1.3 smd: 1(-3.292,2.273) 3(-3.292,-2.273)
  rect 6.5x6 smd: 2(3.292,0)
TSOP-6_L3.0-W1.5-P0.95-LS2.8-BL
  oval 0.531x1.336 smd: 1(-0.95,-1.268) 2(0,-1.268) 3(0.95,-1.268) 4(0.95,1.268) 5(0,1.268) 6(-0.95,1.268)
USIP-8_L3.0-W2.8-P0.65-TL-EP
  rect 0.65x0.45 smd: 1(-1.125,0.975) 2(-1.125,0.325) 3(-1.125,-0.325) 4(-1.125,-0.975) 5(1.125,-0.975) 6(1.125,-0.325) 7(1.125,0.325) 8(1.125,0.975)
  rect 1.1x1.9 smd: 9(0,0)
VQFN-14_L3.5-W3.5-P0.50-TL-EP_TPS54622RHLT
  rect 0.28x0.8 smd: 1(-0.75,1.725) 7(-0.75,-1.725) 8(0.75,-1.725) 14(0.75,1.725)
  rect 0.8x0.28 smd: 2(-1.725,1) 3(-1.725,0.5) 4(-1.725,0) 5(-1.725,-0.5) 6(-1.725,-1) 9(1.725,-1) 10(1.725,-0.5) 11(1.725,0) 12(1.725,0.5) 13(1.725,1)
  custom 2.032x4.32 smd: 15(0,0)

## Nets
3V3CAM: C41.2 C42.2 FPC1.17 FPC1.18 R13.1 U4.5
3V3CORE: C1.1 C2.1 C3.1 C4.1 C5.1 C6.1 C7.1 C8.1 C9.1 C10.1 C17.2 C32.2 C33.2 H1.1 L2.2 Q1.2 R7.1 RN1.7 RN1.8 RN2.5 RN2.6 RN2.7 RN2.8 U1.5 U18.A2 U18.A19 U18.B3 U18.B18 U18.D5 U18.N20 U18.T11 U18.V19 U18.W20
DVDD1: C59.2 R26.1 R28.2 R30.2 R34.2 U12.33
DVDD2: C60.2 R27.1 R29.2 R31.2 R35.2 U13.33
GND: C11.1 C34.2 C35.1 C36.1 C39.1 C40.1 C43.1 C44.1 C45.2 C46.1 C47.1 C48.1 C49.2 C50.1 C51.1 C52.1 C57.1 C58.1 C61.2 C62.2 C65.2 C66.2 C67.1 C68.2 C69.1 C70.2 C71.1 C72.1 C73.1 C74.1 C77.2 C78.2 C79.1 C80.2 C81.1 C82.2 C83.1 C84.1 C85.1 C86.1 CN1.1 CN2.1 CN3.1 D3.1 H2.3 H3.3 H4.3 H5.3 L4.1 L5.1 L6.1 LED2.1 LED3.1 LED5.1 LED6.1 LED9.1 LED10.1 LED11.1 LED12.1 NOREF#5.1 NOREF#9.1 NOREF#10.1 NOREF#11.1 P1.1 Q3.9 Q4.9 Q5.9 Q6.9 Q7.9 Q8.9 R9.2 R16.1 R20.1 R22.1 R32.2 R33.2 R36.2 R37.2 R38.1 R39.1 R45.1 R47.1 R48.1 R49.1 R55.1 R57.1 SW1.2 SW3.3 SW3.4 SW4.5 U2.3 U2.9 U3.2 U5.6 U6.2 U6.3 U6.6 U6.7 U6.10 U6.11 U7.5 U7.6 U8.1 U9.1 U10.1 U11.1 U12.9 U12.10 U12.11 U12.12 U12.19 U12.20 U12.26 U12.29 U12.31 U12.40 U12.41 U13.9 U13.10 U13.11 U13.12 U13.19 U13.20 U13.26 U13.29 U13.31 U13.40 U13.41 U14.2 U14.3 U14.15 U15.2 U15.3 U15.15 U16.2 U16.3 U16.15 U17.2 U17.3 U17.15
GNDCAM: C37.1 C38.1 C41.1 C42.1 FPC1.2 FPC1.7 FPC1.16 L6.2 LED4.1 U4.2
GNDCORE: C1.2 C2.2 C3.2 C4.2 C5.2 C6.2 C7.2 C8.2 C9.2 C10.2 C12.2 C13.2 C14.2 C15.2 C16.2 C17.1 C18.1 C19.2 C20.2 C21.1 C22.2 C23.2 C24.2 C25.2 C26.1 C30.1 C31.1 C32.1 C33.1 H1.3 H1.5 L3.2 L4.2 L5.2 LED1.1 Q1.5 RN1.5 RN1.6 U1.2 U18.A20 U18.B2 U18.B19 U18.D4 U18.D17 U18.E5 U18.E16 U18.G9 U18.G10 U18.G11 U18.G12 U18.H9 U18.H10 U18.H11 U18.H12 U18.J7 U18.J8 U18.J10 U18.J11 U18.J13 U18.J14 U18.K7 U18.K8 U18.K9 U18.K10 U18.K11 U18.K12 U18.K13 U18.L7 U18.L8 U18.L9 U18.L10 U18.L11 U18.L12 U18.L13 U18.L14 U18.L20 U18.M7 U18.M8 U18.M10 U18.M11 U18.M13 U18.M14 U18.N9 U18.N10 U18.N11 U18.N12 U18.P9 U18.P10 U18.P11 U18.P12 U18.T16 U18.U17 U18.W19 U18.Y20
VBAT: C45.1 C47.2 C55.1 C56.1 C57.2 C58.2 C65.1 C66.1 C67.2 C69.2 C77.1 C78.1 C79.2 C81.2 D3.2 Q2.2 Q3.1 Q3.2 Q4.1 Q4.2 Q5.1 Q5.2 Q6.1 Q6.2 Q7.1 Q7.2 Q8.1 Q8.2 R14.2 R15.2 R18.1 R19.1 R21.2 U5.4 U12.4 U12.5 U13.4 U13.5 U14.4 U14.5 U14.6 U15.4 U15.5 U15.6 U16.4 U16.5 U16.6 U17.4 U17.5 U17.6
VCC1V3: C12.1 C13.1 C14.1 C15.1 C16.1 C18.2 C19.1 C20.1 C22.1 C23.1 C24.1 C25.1 L1.2 U18.D16 U18.E15 U18.G8 U18.G13 U18.H7 U18.H14 U18.N7 U18.N14 U18.N19 U18.P8 U18.P13
VCC3V3: C39.2 C40.2 C50.2 C51.2 C52.2 P1.2 R1.2 R12.1 R23.2 R24.1 R25.1 RN3.5 RN3.6 RN3.7 RN3.8 U3.5 U6.5 U6.8 U7.4
VCC5V: C30.2 C31.2 C35.2 C36.2 C37.2 C38.2 C44.2 C61.1 C62.1 CN2.6 CN3.6 R8.2 R10.1 R11.2 U1.1 U1.3 U2.4 U2.5 U3.1 U3.3 U4.1 U4.3 U7.2 U12.24 U12.30 U13.24 U13.30
VCC12V: C43.2 C46.2 R17.2 U2.1 U2.2 U5.3
VCCSERA: H2.2 L7.2 NOREF#12.1 R40.2 R41.2
VCCSERB: H3.2 L8.2 NOREF#6.1 R42.2 R43.2
VCCSERC: H4.2 L9.2 NOREF#14.1 R50.2 R51.2
VCCSERD: H5.2 L10.2 NOREF#2.1 R52.2 R53.2
VDDM: C27.1 L2.1 R3.2 R4.2 U18.Y5
VSSM: C27.2 L3.1 R5.2 R6.2 U18.Y4
AN0: U18.T10
AN1: U18.U10
AN2: U18.W9
AN3: U18.U9
AN4: U18.T9
AN5: C49.1 R21.1 R22.2 U18.Y9
AN6: U18.T8
AN7: U18.U8
AN8: U18.W8
AN9: U18.U7
AN10: U18.Y8
AN11: U18.W7
AN12: U18.T7
AN13: U18.W6
AN14: U18.U6
AN15: U18.T6
AN16: U18.W5
AN17: U18.U5
AN18: U18.W4
AN19: U18.W3
AN20: U18.Y3
AN21: U18.Y2
AN22: U18.T5
AN23: U18.R5
AN24: U18.W2
AN25: U18.W1
AN26: U18.V2
AN27: U18.V1
AN28: U18.U2
AN29: U18.U1
AN30: U18.T4
AN31: U18.R4
AN32: U18.P4
AN33: U18.R1
AN34: U18.P5
AN35: U18.R2
AN36: U18.N4
AN37: U18.P2
AN38: U18.N5
AN39: U18.P1
AN40: U18.M5
AN41: U18.M4
AN42: U18.L5
AN43: U18.L4
AN44: U18.N1
AN45: U18.N2
AN46: U18.M1
AN47: U18.M2
CSA: CN2.2 U18.Y13
CSB: CN3.2 U18.A10
ESR0#: U18.F16
ESR1#: U18.G16
GHA: Q3.3 U12.6
GHB: Q5.3 U12.15
GHC: Q7.3 U12.16
GHX: Q4.3 U13.6
GHY: Q6.3 U13.15
GHZ: Q8.3 U13.16
GLA: Q3.5 U12.8
GLB: Q5.5 U12.13
GLC: Q7.5 U12.18
GLX: Q4.5 U13.8
GLY: Q6.5 U13.13
GLZ: Q8.5 U13.18
HCRX: U7.3 U18.Y14
HCTX: U7.1 U18.W14
ICM_CS: U6.12 U18.D20
ICM_MISO: U6.1 U18.D19
ICM_MOSI: U6.14 U18.C20
ICM_SCL: U6.13 U18.E20
IDRIVE1: R34.1 R36.1 U12.27
IDRIVE2: R35.1 R37.1 U13.27
MISOA: CN2.3 U18.Y16
MISOB: CN3.3 U18.B10
MOSIA: CN2.4
MOSIB: CN3.4
NFAULT1: LED8.1 R26.2 U12.25
NFAULT2: LED7.1 R27.2 U13.25
P00.0: FPC1.8 U18.G1
P00.1: FPC1.9 U18.G2
P00.2: FPC1.10 U18.H1
P00.3: FPC1.11 U18.H2
P00.4: FPC1.12 U18.J1
P00.5: FPC1.13 U18.J2
P00.6: FPC1.14 U18.J4
P00.7: FPC1.15 U18.K1
P00.8: U18.K4
P00.9: U18.K2
P00.10: U18.K5
P00.11: U18.L1
P00.12: H2.1 U18.L2
P01.3: U18.G5
P01.4: U18.G4
P01.5: U18.H5
P01.6: U18.H4
P01.7: U18.J5
P02.0: FPC1.6 U18.B1
P02.1: FPC1.1 U18.C2
P02.2: FPC1.4 U18.C1
P02.3: FPC1.3 U18.D2
P02.4: U18.D1
P02.5: U18.E2
P02.6: U18.E1
P02.7: U18.F2
P02.8: U18.F1
P02.9: U18.E4
P02.10: U18.F5
P02.11: U18.F4
P10.0: U13.38 U18.A7
P10.1: U18.B7
P10.2: U13.36 U18.A5
P10.3: U13.37 U18.A6
P10.4: U18.B6
P10.5: RN2.2 U18.B5
P10.6: RN2.1 U18.A4
P10.7: U18.A3
P10.8: U13.39 U18.B4
P11.0: U18.E10
P11.1: U18.E9
P11.4: U18.D10
P11.5: U18.D8
P11.6: CN3.5 U18.D9
P11.7: U18.E8
P11.8: U18.E7
P11.9: U18.A9
P11.10: H5.1 U18.B9
P11.11: H4.1 U18.A8
P11.12: U18.B8
P11.13: U18.E6
P11.14: U18.D7
P11.15: U18.D6
P12.0: U18.E12
P12.1: U18.E11
P13.0: U18.B12
P13.1: U18.A12
P13.2: U18.B11
P13.3: U18.A11
P14.0: H1.7 U18.B16
P14.1: H1.9 U18.A15
P14.2: RN2.3 U18.E13
P14.3: RN1.2 U18.B14
P14.4: RN1.4 U18.B15
P14.5: RN1.3 U18.A14
P14.6: RN1.1 U18.B13
P14.7: U13.34 U18.D13
P14.8: R23.1 SW4.6 U18.A13
P14.9: U18.D12
P14.10: U18.D11
P15.0: P1.6 U18.B20
P15.1: P1.5 U18.A18
P15.2: P1.7 U18.C19
P15.3: P1.3 U18.B17
P15.4: P1.8 U18.A17
P15.5: P1.4 U18.E14
P15.6: RN3.1 SW4.3 U18.A16
P15.7: U18.D15
P15.8: U13.35 U18.D14
P20.0: RN3.4 SW4.4 U18.H20
P20.1: U18.G19
P20.2: RN2.4 U18.H19
P20.3: RN3.3 SW4.1 U18.G20
P20.6: U18.F17
P20.7: U18.F19
P20.8: RN3.2 SW4.2 U18.F20
P20.9: U18.E17
P20.10: U18.E19
P21.0: U18.K17
P21.1: U18.J17
P21.2: U18.K19
P21.3: U18.J19
P21.4: R25.2 SW3.1 U18.K20
P21.5: R24.2 SW3.2 U18.J20
P21.6: U18.H17
P21.7: H1.6 U18.H16
P22.0: U12.35 U18.P20
P22.1: U12.34 U18.P19
P22.2: U12.37 U18.R20
P22.3: U12.36 U18.R19
P22.4: U18.P16
P22.5: U18.P17
P22.6: U18.N16
P22.7: U18.N17
P22.8: U18.M16
P22.9: U18.M17
P22.10: U18.L16
P22.11: U18.L17
P23.0: U18.V20
P23.1: U12.39 U18.U19
P23.2: U18.U20
P23.3: U18.T19
P23.4: U18.T20
P23.5: U18.T17
P23.6: U18.R17
P23.7: U18.R16
P32.2: U18.Y18
P32.3: U18.Y19
P32.4: U12.38 U18.W18
P32.5: U18.T15
P32.6: U18.U15
P32.7: U18.U16
P33.0: U18.W10
P33.1: U18.Y10
P33.2: U18.W11
P33.3: U18.Y11
P33.4: H3.1 U18.W12
P33.5: U18.Y12
P33.6: U18.W13
P33.10: U18.W15
P33.11: CN2.5 U18.Y15
P33.12: U18.W16
P33.14: U18.T14
P33.15: U18.U14
P34.1: U18.U11
P34.2: U18.T12
P34.3: U18.U12
P34.4: U18.T13
P34.5: U18.U13
PG: R11.1 U2.7
RST: H1.10 R2.1 U18.G17
SHA: NOREF#8.1 Q3.4 Q3.6 Q3.7 Q3.8 U12.7
SHB: NOREF#4.1 Q5.4 Q5.6 Q5.7 Q5.8 U12.14
SHC: NOREF#7.1 Q7.4 Q7.6 Q7.7 Q7.8 U12.17
SHX: NOREF.1 Q4.4 Q4.6 Q4.7 Q4.8 U13.7
SHY: NOREF#13.1 Q6.4 Q6.6 Q6.7 Q6.8 U13.14
SHZ: NOREF#3.1 Q8.4 Q8.6 Q8.7 Q8.8 U13.17
TCK: H1.4 U18.J16
TMS: H1.2 U18.K16
TRST: H1.8 U18.L19
VAGND1: C28.2 R5.1 U18.Y7
VAGND2: C29.2 R6.1 U18.T2
VAREF1: C28.1 R3.1 U18.Y6
VAREF2: C29.1 R4.1 U18.T1
VDS1: R30.1 R32.1 U12.28
VDS2: R31.1 R33.1 U13.28
VGATE1N: Q1.1 U18.Y17
VGATE1P: Q1.3 U18.W17
VSEA: R40.1 R45.2 U14.7
VSEB: R42.1 R47.2 U15.7
VSEC: R50.1 R55.2 U16.7
VSED: R52.1 R57.2 U17.7
$1N5868: LED1.2 R7.2
$1N19321: C21.2 U18.M20 X1.3
$1N20847: C26.2 U18.M19 X1.1
$1N21074: C11.2 R1.1 R2.2 SW1.1
$1N22345: L1.1 Q1.4 Q1.6
$2N1087: D1.2 R20.2 SW2.3
$2N1088: CN1.2 D1.1 Q2.3 SW2.1
$2N1092: Q2.1 SW2.2
$2N3737: C48.2 R19.2 U5.5
$2N5107: R15.1 R16.2 U5.1
$2N5228: R18.2 U5.2
$2N5353: LED3.2 R12.2
$2N5428: LED4.2 R13.2
$2N30786: R8.1 R9.1 U2.6
$2N30791: C34.1 U2.8
$2N32992: LED6.2 R17.1
$2N33117: LED5.2 R14.1
$2N41809: LED2.2 R10.2
$4N23113: C53.2 U12.1
$4N23118: C53.1 U12.2
$4N23217: C55.2 U12.3
$4N24188: C59.1 U12.32
$4N25223: C54.2 U13.1
$4N25226: C54.1 U13.2
$4N25270: C56.2 U13.3
$4N25283: C60.1 U13.32
$4N29086: LED8.2 R28.1
$4N29088: LED7.2 R29.1
$5N27726: C63.2 L7.1 U14.11 U14.12
$5N28006: C68.1 U14.9
$5N28121: C63.1 U14.13
$5N28613: C73.2 R44.1
$5N28617: C71.2 R44.2 U14.8
$5N29262: C70.1 U15.9
$5N29270: C72.2 R46.2 U15.8
$5N29274: C64.2 L8.1 U15.11 U15.12
$5N29282: C74.2 R46.1
$5N29295: C64.1 U15.13
$5N29303: R39.2 U15.1
$5N29919: C80.1 U16.9
$5N29927: C83.2 R54.2 U16.8
$5N29931: C75.2 L9.1 U16.11 U16.12
$5N29939: C85.2 R54.1
$5N29952: C75.1 U16.13
$5N29960: R48.2 U16.1
$5N30576: C82.1 U17.9
$5N30584: C84.2 R56.2 U17.8
$5N30588: C76.2 L10.1 U17.11 U17.12
$5N30596: C86.2 R56.1
$5N30609: C76.1 U17.13
$5N30617: R49.2 U17.1
$5N34622: LED9.2 R41.1
$5N34624: LED10.2 R43.1
$5N34626: LED12.2 R53.1
$5N34628: LED11.2 R51.1
$5N38671: R38.2 U14.1

Pads without a net: CN1 3 4; CN2 7 8; CN3 7 8; FPC1 5 19 20; SW2 4 5; SW4 7; U1 4; U3 4; U4 4; U6 4 9; U12 21 22 23; U13 21 22 23; U14 10 14; U15 10 14; U16 10 14; U17 10 14; U18 A1 K14 U4 Y1; X1 2 4

## Via types
v1: diameter 0.61, hole 0.305, Top Layer to Bottom Layer, 993 vias
v2: diameter 0.508, hole 0.305, Top Layer to Bottom Layer, 1 via

## Routing (per net, layer and track width the routed paths; a pad name or vN(x,y) marks a point on that pad's centre or on a via; arc(x,y) is an arc through that point)
3V3CAM: length 24.1
  Top Layer w0.508: 42.93,54.52 42.92,54.52 42.49,54.52 ; R13.1 33.77,44.12 34.93,45.27 41.5,45.27 42.93,46.7 42.93,54.08 42.49,54.52 ; FPC1.18 42.49,54.52
3V3CORE: length 130.2
  Top Layer w0.152: U18.V19 U18.W20 36.31,24.39 v1(35.73,24.39) ; U18.A2 U18.B3 ; v1(41.64,24.58) 41.69,24.62 U18.N20 ; v1(55.13,39.62) 54.15,39.62 53.56,40.21 53,40.21 v1(51.85,39.06) ; U18.A19 U18.B18 ; v1(41.17,42.38) 41.03,42.24 L2.2
  Top Layer w0.254: U18.A2 51.54,39.37 v1(51.85,39.06) ; v1(41.64,24.58) 41.51,24.44 40.82,24.44 37.42,21.04 37.42,20.53 38.34,19.6 46.15,19.6 v1(46.22,19.53) ; U18.A19 51.98,25.08 v1(52.07,25.08) ; v1(40.15,28.83) 39.77,29.21 39.77,31.69 U18.T11
  Inner1 w0.152: v1(44.4,29.14) 43.81,28.56 43.81,28.5 ; v2(41.91,29.08) 41.91,28.5
  Inner1 w0.254: v1(40.15,28.83) 40.47,28.5 43.81,28.5 45.85,26.47 ; v1(48.82,36.83) 48.82,36.7 49.15,36.38 50.8,36.38 51.98,37.55 ; 45.85,26.47 v1(47.06,26.47) 48.45,25.08 v1(52.07,25.08) 51.35,25.79 51.35,33.22 v1(51.94,33.81) 51.94,35.34 v1(52.09,35.49) 52.09,37.39 v1(51.98,37.5) 51.98,37.55 ; 45.85,26.47 43.37,23.99 42.13,23.99 41.53,24.59 41.62,24.59 v1(41.64,24.58) ; v1(51.85,39.06) 51.98,38.93 51.98,37.55
  Bottom Layer w0.152: v1(55.13,39.62) 55.13,42.02 53.21,43.94 47.15,43.94 44.91,46.18 42.44,46.18 41.47,47.16 40.37,47.16 40.13,46.92 40.13,43.41 v1(41.17,42.38) ; v1(51.85,39.06) 53.73,39.06 54.48,38.31 54.48,36.73 54.85,36.36 55.13,36.36 55.13,35.56 ; C2.1 43.82,28.57 v1(44.4,29.14) ; v1(35.73,24.39) 36.13,24.8 C17.2
  Bottom Layer w0.254: C10.1 47.18,26.6 v1(47.06,26.47) ; H1.1 50.92,4.26 50.92,18.65 50.04,19.53 v1(46.22,19.53)
  Bottom Layer w0.508: C3.1 37.92,28.57 37.22,27.87 Q1.2
  vias: v1(32.05,27.1) v1(32.76,27.1)
DVDD1: length 22.1
  Top Layer w0.152: R28.2 17.26,12.63 18.32,13.69 19.78,13.69 R34.2 20.57,12.25 20.19,11.87 18.77,11.87 18.41,11.5 18.41,10.45 18.63,10.23 21.34,10.23 22.22,11.11 C59.2
  Top Layer w0.254: C59.2 22.95,13.67 22.95,16.01 23.62,16.67 23.62,17.46 23.14,17.94 U12.33
DVDD2: length 16.3
  Top Layer w0.152: R29.2 65.37,24.35 R27.1 63.17,23.55 61.73,23.55 R35.2 60.21,25.08 58.93,25.08 58.67,24.82 58.67,23.62 R31.2
  Top Layer w0.254: U13.33 59.53,19.31 59.03,19.8 C60.2 57.56,20.53 57.56,22.51 R31.2
GND: length 72.7
  Top Layer w0.152: R16.1 22.72,29.39 v1(22.52,29.59) ; C74.1 9.07,39.49 v1(8.37,40.19) ; 52.01,22.12 51.6,22.12 51.45,21.97 51.45,21.28 51.25,21.08 U6.7 ; R45.1 7.7,51.74 v1(8.37,51.06) 8.49,51.06 C73.1 ; R37.2 62.48,24.38 62.48,25.63 62.45,25.65 ; v1(19.05,28.89) 19.17,28.76 LED6.1 ; R47.1 8.37,40.19 ; C70.2 13.78,40.19 v1(13.66,40.19) 12.96,39.5 C72.1 ; R32.2 17.53,11.38 R36.2 ; C57.1 19.56,26.96 v1(19.96,27.37) ; 62.45,25.65 59.68,25.65 C11.1 58.86,26.26 57.89,25.28 R33.2 ; 62.45,25.65 SW1.2 ; v1(22.94,33.13) 22.6,33.47 LED2.1 ; C68.2 13.82,50.94 v1(13.66,50.94) 13.01,50.29 C71.1
  Top Layer w0.254: U12.40 21.81,21.44 U12.41 ; U13.20 65.72,20.31 65.22,19.81 ; v1(63.11,19.48) 63.22,19.58 U13.26 ; U13.29 61.72,19.81 61.22,20.31 U13.31 ; U12.41 17.31,16.94 U12.20 ; U12.41 19.81,18.94 U12.26 ; U13.41 61.22,15.81 U13.40 ; U13.41 62.22,19.3 ; U13.41 65.07,16.46 ; U13.41 65.22,19.81 ; U12.19 17.46,17.44 v1(17.78,17.77) ; U13.19 65.22,19.81 ; 21.16,17.59 20.1,18.66 ; U12.12 17.46,20.94 v1(17.78,20.61) 17.81,20.64 U12.9 ; U12.31 21.81,16.94 ; U13.10 65.72,15.81 U13.11 ; U13.12 65.22,16.31 U13.9 ; 21.31,17.74 v1(21.34,17.77) ; U12.10 17.31,21.44 U12.11 ; 19.62,30.54 U2.3 19.62,33.12 v1(19.65,33.15) ; 21.31,17.59 U12.29
  Top Layer w0.508: LED3.1 28.48,33.64 v1(27.73,33.64) 27.72,33.63 v1(27.12,33.63) 27.08,33.58 L6.1 ; C39.1 C40.1
  vias: v1(0.85,55.15) v1(0.85,54.44) v1(0.85,52.99) v1(0.85,52.28) v1(0.85,44.35) v1(0.85,43.64) v1(0.85,42.19) v1(0.85,41.48) v1(1.56,55.15) v1(1.56,54.44) v1(1.56,52.99) v1(1.56,52.28) v1(1.56,44.35) v1(1.56,43.64) v1(1.56,42.19) v1(1.56,41.48) v1(4.75,36.19) v1(5.61,36.19) v1(6.07,25.37) v1(6.07,24.66) v1(6.07,23.95) v1(6.07,23.24) v1(6.07,22.53) v1(6.07,20.04) v1(6.07,19.33) v1(6.07,18.61) v1(6.07,17.9) v1(6.07,17.19) v1(6.07,14.7) v1(6.07,13.99) v1(6.07,13.28) v1(6.07,12.57) v1(6.07,11.86) v1(6.07,11.15) v1(6.35,56.01) v1(6.35,45.22) v1(6.46,36.19) v1(6.78,25.37) v1(6.78,24.66) v1(6.78,23.95) v1(6.78,23.24) v1(6.78,22.53) v1(6.78,20.04) v1(6.78,19.33) v1(6.78,18.61) v1(6.78,17.9) v1(6.78,17.19) v1(6.78,14.7) v1(6.78,13.99) v1(6.78,13.28) v1(6.78,12.57) v1(6.78,11.86) v1(6.78,11.15) v1(7.01,55.78) v1(7.01,55.07) v1(7.01,44.99) v1(7.01,44.28) v1(7.49,25.37) v1(7.49,24.66) v1(7.49,23.95) v1(7.49,23.24) v1(7.49,22.53) v1(7.49,20.04) v1(7.49,19.33) v1(7.49,18.61) v1(7.49,17.9) v1(7.49,17.19) v1(7.49,14.7) v1(7.49,13.99) v1(7.49,13.28) v1(7.49,12.57) v1(7.49,11.86) v1(7.49,11.15) v1(7.72,55.78) v1(7.72,55.07) v1(7.72,44.99) v1(7.72,44.28) v1(8.2,25.37) v1(8.2,24.66) v1(8.2,23.95) v1(8.2,23.24) v1(8.2,22.53) v1(8.2,20.04) v1(8.2,19.33) v1(8.2,18.61) v1(8.2,17.9) v1(8.2,17.19) v1(8.2,14.7) v1(8.2,13.99) v1(8.2,13.28) v1(8.2,12.57) v1(8.2,11.86) v1(8.2,11.15) v1(8.92,25.37) v1(8.92,24.66) v1(8.92,23.95) v1(8.92,23.24) v1(8.92,22.53) v1(8.92,20.04) v1(8.92,19.33) v1(8.92,18.61) v1(8.92,17.9) v1(8.92,17.19) v1(8.92,14.7) v1(8.92,13.99) v1(8.92,13.28) v1(8.92,12.57) v1(8.92,11.86) v1(8.92,11.15) v1(10.72,35.06) v1(10.72,4.58) v1(10.82,34.37) v1(11.92,29.14) v1(12.7,29.14) v1(13.46,29.08) v1(13.68,34.38) v1(14.41,14.28) v1(15.09,34.38) v1(15.49,37.16) v1(15.84,34.37) v1(17.14,37.26) v1(17.26,34.37) v1(17.76,50.18) v1(17.78,39.39) v1(17.78,19.9) v1(17.78,19.19) v1(17.78,18.48) v1(18.5,20.61) v1(18.5,19.9) v1(18.5,19.19) v1(18.5,18.48) v1(18.5,17.77) v1(18.94,33.15) v1(19.05,12.85) v1(19.21,20.61) v1(19.21,19.9) v1(19.21,19.19) v1(19.21,18.48) v1(19.21,17.77) v1(19.92,20.61) v1(19.92,19.9) v1(19.92,19.19) v1(19.92,18.48) v1(19.92,17.77) v1(20.63,20.61) v1(20.63,19.9) v1(20.63,19.19) v1(20.63,18.48) v1(20.63,17.77) v1(20.88,50.3) v1(20.88,40.14) v1(21.34,20.61) v1(21.34,19.9) v1(21.34,19.19) v1(21.34,18.48) v1(21.84,37.16) v1(25.96,50.3) v1(25.96,45.22) v1(25.96,4.58) v1(26.61,30.36) v1(26.8,19.91) v1(26.8,19.2) v1(26.8,18.49) v1(26.8,17.78) v1(26.8,17.07) v1(27.51,19.91) v1(27.51,19.2) v1(27.51,18.49) v1(27.51,17.78) v1(27.51,17.07) v1(27.85,31.05) v1(28.22,19.91) v1(28.22,19.2) v1(28.22,18.49) v1(28.22,17.78) v1(28.22,17.07) v1(28.93,19.91) v1(28.93,19.2) v1(28.93,18.49) v1(28.93,17.78) v1(28.93,17.07) v1(29.64,19.91) v1(29.64,19.2) v1(29.64,18.49) v1(29.64,17.78) v1(29.64,17.07) v1(30.35,19.91) v1(30.35,19.2) v1(30.35,18.49) v1(30.35,17.78) v1(30.35,17.07) v1(31.04,19.82) v1(31.04,4.58) v1(31.16,30.75) v1(31.5,22.15) v1(32,30.84) v1(32.6,22.15) v1(33.44,22.15) v1(33.89,0.64) v1(36.12,55.38) v1(36.12,50.3) v1(42.01,13.44) v1(42.01,12.73) v1(42.01,12.02) v1(42.01,11.31) v1(42.72,13.44) v1(42.72,12.73) v1(42.72,12.02) v1(42.72,11.31) v1(43.43,13.44) v1(43.43,12.73) v1(43.43,12.02) v1(43.43,11.31) v1(44.15,13.44) v1(44.15,12.73) v1(44.15,12.02) v1(44.15,11.31) v1(44.86,13.44) v1(44.86,12.73) v1(44.86,12.02) v1(44.86,11.31) v1(45.69,13.44) v1(45.69,12.73) v1(45.69,12.02) v1(45.69,11.31) v1(46.41,13.44) v1(46.41,12.73) v1(46.41,12.02) v1(46.41,11.31) v1(47.12,13.44) v1(47.12,12.73) v1(47.12,12.02) v1(47.12,11.31) v1(47.83,13.44) v1(47.83,12.73) v1(47.83,12.02) v1(48.54,13.44) v1(48.54,12.73) v1(49.95,17.58) v1(56.44,55.38) v1(56.44,50.3) v1(56.44,45.22) v1(61.52,50.3) v1(61.52,35.06) v1(61.52,29.98) v1(61.69,18.77) v1(61.69,18.06) v1(61.69,17.35) v1(61.69,16.63) v1(62,12.02) v1(62.4,19.48) v1(62.4,18.77) v1(62.4,18.06) v1(62.4,17.35) v1(62.4,16.63) v1(62.45,24.4) v1(63.11,18.77) v1(63.11,18.06) v1(63.11,17.35) v1(63.11,16.63) v1(63.82,19.48) v1(63.82,18.77) v1(63.82,18.06) v1(63.82,17.35) v1(63.82,16.63) v1(64.53,19.48) v1(64.53,18.77) v1(64.53,18.06) v1(64.53,17.35) v1(64.53,16.63) v1(65.24,19.48) v1(65.24,18.77) v1(65.24,18.06) v1(65.24,17.35) v1(65.24,16.63) v1(66.6,14.74) v1(67.09,22.97) v1(70.29,58.14) v1(70.29,47.3) v1(74.83,25.26) v1(74.83,24.55) v1(74.83,23.84) v1(74.83,23.13) v1(74.83,22.42) v1(74.83,19.95) v1(74.83,19.24) v1(74.83,18.53) v1(74.83,17.82) v1(74.83,17.11) v1(74.83,14.62) v1(74.83,13.91) v1(74.83,13.2) v1(74.83,12.48) v1(74.83,11.77) v1(74.83,11.06) v1(75.54,25.26) v1(75.54,24.55) v1(75.54,23.84) v1(75.54,23.13) v1(75.54,22.42) v1(75.54,19.95) v1(75.54,19.24) v1(75.54,18.53) v1(75.54,17.82) v1(75.54,17.11) v1(75.54,14.62) v1(75.54,13.91) v1(75.54,13.2) v1(75.54,12.48) v1(75.54,11.77) v1(75.54,11.06) v1(75.58,58.02) v1(75.58,47.3) v1(76.23,54.01) v1(76.23,53.3) v1(76.23,43.21) v1(76.23,42.5) v1(76.25,25.26) v1(76.25,24.55) v1(76.25,23.84) v1(76.25,23.13) v1(76.25,22.42) v1(76.25,19.95) v1(76.25,19.24) v1(76.25,18.53) v1(76.25,17.82) v1(76.25,17.11) v1(76.25,14.62) v1(76.25,13.91) v1(76.25,13.2) v1(76.25,12.48) v1(76.25,11.77) v1(76.25,11.06) v1(76.94,54.01) v1(76.94,53.3) v1(76.94,43.21) v1(76.94,42.5) v1(76.96,25.26) v1(76.96,24.55) v1(76.96,23.84) v1(76.96,23.13) v1(76.96,22.42) v1(76.96,19.95) v1(76.96,19.24) v1(76.96,18.53) v1(76.96,17.82) v1(76.96,17.11) v1(76.96,14.62) v1(76.96,13.91) v1(76.96,13.2) v1(76.96,12.48) v1(76.96,11.77) v1(76.96,11.06) v1(77.6,53.07) v1(77.6,42.28) v1(77.62,28.69) v1(77.68,25.26) v1(77.68,24.55) v1(77.68,23.84) v1(77.68,23.13) v1(77.68,22.42) v1(77.68,19.95) v1(77.68,19.24) v1(77.68,18.53) v1(77.68,17.82) v1(77.68,17.11) v1(77.68,14.62) v1(77.68,13.91) v1(77.68,13.2) v1(77.68,12.48) v1(77.68,11.77) v1(77.68,11.06) v1(78.46,28.69) v1(79.32,28.69) v1(81.84,9.66) v1(81.84,4.58) v1(82.39,56.8) v1(82.39,56.09) v1(82.39,54.64) v1(82.39,53.93) v1(82.39,46.01) v1(82.39,45.3) v1(82.39,43.85) v1(82.39,43.14) v1(83.1,56.8) v1(83.1,56.09) v1(83.1,54.64) v1(83.1,53.93) v1(83.1,46.01) v1(83.1,45.3) v1(83.1,43.85) v1(83.1,43.14)
GNDCAM: length 48.7
  Top Layer w0.381: FPC1.2 50.49,55.28 50.09,55.68 48.39,55.68 48.01,55.3 ; 48.01,55.3 47.99,55.29 47.99,54.53 FPC1.7 ; 48.01,55.3 47.62,55.68 43.89,55.68 43.49,55.29 43.49,54.53 FPC1.16 ; v1(27.63,38.22) 28.07,38.66 LED4.1
  Top Layer w0.508: 25.08,33.58 25.08,35.11 C37.1 C38.1 27.11,35.3 27.81,36 U4.2 ; 43.51,55.39 43.47,55.39 43.3,55.55 42.16,55.55 41.38,54.77 41.38,46.33 40.92,45.88 34.67,45.88 33.16,44.37 33.16,40.2 32.64,39.68 29.34,39.68 28.54,38.88 LED4.1 ; v1(31.29,35.72) 31.58,35.72 C41.1 C42.1
  vias: v1(25.6,35.32) v1(27.07,34.61) v1(32.71,35.32)
GNDCORE: length 124.1
  Top Layer w0.152: v1(48.1,28.03) 48.76,27.37 U18.D17 U18.B19 U18.A20 ; v1(38.54,27.37) 39.29,28.12 U18.T16 ; v1(43.31,45.65) 42.56,45.65 40.78,43.87 L3.2 ; LED1.1 28.81,27.85 v1(28.81,27.63) ; v1(50.49,39.37) 50.06,38.94 49.81,38.94 48.89,38.01 U18.D4 U18.E5 47.41,36.29 v1(47.41,35.13)
  Top Layer w0.254: H1.3 55.12,2.6 51.75,2.6 v1(51.66,2.69) ; v1(34.84,25.11) 35.94,25.11 U18.Y20 U18.W19 ; v1(34.84,25.11) v1(34.84,27.78) ; v1(34.84,25.11) 34.73,25.01 C33.1
  Top Layer w0.508: U1.2 27.81,25.58 27.24,25.01 C31.1
  Inner1 w0.152: v1(44.68,24.01) 44.86,24.19 v1(48.13,24.19)
  Inner1 w0.254: v1(55.13,37.96) 53.99,39.1 52.64,39.1 52.09,39.64 50.76,39.64 50.42,39.3 ; v1(40.35,29.97) 38.54,28.16 v1(38.54,27.37) ; v1(39.65,20.19) 39.65,20.35 38.16,21.84 37.36,21.84 36.11,23.09 34.94,23.09 34.59,23.44 34.59,24.87 v1(34.84,25.11) ; v1(48.1,28.03) 47.24,28.89 v1(47.24,29.9) 46.23,30.92 v1(44.58,30.92)
  Bottom Layer w0.152: 41.71,27.26 42.4,26.57 42.4,26.25 43.17,25.48 v1(43.17,24.8) ; 41.71,27.26 38.48,24.03 38.48,22.22 C26.1 ; 41.71,27.26 41.6,27.37 v1(38.54,27.37) ; v1(49.78,35.33) 50.19,35.33 C6.2 ; 47.39,35.11 v1(47.41,35.13) 47.93,35.64 47.93,36.96 47.05,37.84 47.05,40.63 47.62,41.2 47.62,43.11 45.09,45.65 v1(43.31,45.65) ; C9.2 45.78,26.21 47.81,24.19 v1(48.13,24.19)
  Bottom Layer w0.254: v1(34.84,27.78) 34.75,27.87 Q1.5 ; C10.2 C9.2 ; v1(43.17,24.8) 44.03,24.8 C21.1 46.86,21.97 46.86,21 45.64,19.77 45.64,19.19 45.97,18.85 50.21,18.85 50.56,18.51 50.56,3.79 v1(51.66,2.69) ; v1(39.65,20.19) 39.65,21.05 C26.1 ; H1.3 H1.5 ; v1(55.13,37.96) 55.13,37.16
  vias: v1(24.19,24.3) v1(25.74,24.18) v1(27.31,24.15) v1(31.12,23.92) v1(32.93,23.95) v1(42.53,33.74) v1(42.83,34.94) v1(42.8,30.92) v1(43.5,30.06) v1(44.61,34.94) v1(44.85,33.74)
VBAT: length 7.4
  Top Layer w0.152: R18.1 21.4,25.65 C55.1
  Bottom Layer w0.254: D3.2 28.07,11.1 28.07,7.81 R21.2
  vias: v1(4.04,37.95) v1(4.04,37.24) v1(4.75,37.95) v1(4.75,37.24) v1(5.46,37.95) v1(5.46,37.24) v1(6.17,37.95) v1(6.17,37.24) v1(6.88,37.95) v1(6.88,37.24) v1(7.59,37.95) v1(7.59,37.24) v1(7.59,36.53) v1(7.59,35.82) v1(8.31,37.95) v1(8.31,37.24) v1(8.31,36.53) v1(8.31,35.82) v1(26.8,13.08) v1(26.8,12.37) v1(26.8,11.66) v1(26.8,10.95) v1(26.8,10.24) v1(27.51,13.08) v1(27.51,12.37) v1(27.51,11.66) v1(27.51,10.95) v1(27.51,10.24) v1(28.22,13.08) v1(28.22,12.37) v1(28.22,11.66) v1(28.22,10.95) v1(28.22,10.24) v1(28.93,13.08) v1(28.93,12.37) v1(28.93,11.66) v1(28.93,10.95) v1(28.93,10.24) v1(29.64,13.08) v1(29.64,12.37) v1(29.64,11.66) v1(29.64,10.95) v1(29.64,10.24) v1(30.35,13.08) v1(30.35,12.37) v1(30.35,11.66) v1(30.35,10.95) v1(30.35,10.24) v1(41.66,8.72) v1(41.66,8.01) v1(41.66,7.29) v1(41.66,6.58) v1(41.66,5.87) v1(41.66,5.16) v1(41.66,4.45) v1(41.66,3.74) v1(42.37,8.72) v1(42.37,8.01) v1(42.37,7.29) v1(42.37,6.58) v1(42.37,5.87) v1(42.37,5.16) v1(42.37,4.45) v1(42.37,3.74) v1(43.08,8.72) v1(43.08,8.01) v1(43.08,7.29) v1(43.08,6.58) v1(43.08,5.87) v1(43.08,5.16) v1(43.08,4.45) v1(43.08,3.74) v1(43.79,8.72) v1(43.79,8.01) v1(43.79,7.29) v1(43.79,6.58) v1(43.79,5.87) v1(43.79,5.16) v1(43.79,4.45) v1(43.79,3.74) v1(44.5,8.72) v1(44.5,8.01) v1(44.5,7.29) v1(44.5,6.58) v1(44.5,5.87) v1(44.5,5.16) v1(44.5,4.45) v1(44.5,3.74) v1(45.21,8.72) v1(45.21,8.01) v1(45.21,7.29) v1(45.21,6.58) v1(45.21,5.87) v1(45.21,5.16) v1(45.21,4.45) v1(45.21,3.74) v1(45.92,8.72) v1(45.92,8.01) v1(45.92,7.29) v1(45.92,6.58) v1(45.92,5.87) v1(45.92,5.16) v1(45.92,4.45) v1(45.92,3.74) v1(46.63,8.72) v1(46.63,8.01) v1(46.63,7.29) v1(46.63,6.58) v1(46.63,5.87) v1(46.63,5.16) v1(46.63,4.45) v1(46.63,3.74) v1(47.35,8.72) v1(47.35,8.01) v1(47.35,7.29) v1(47.35,6.58) v1(47.35,5.87) v1(47.35,5.16) v1(47.35,4.45) v1(47.35,3.74) v1(75.43,39.53) v1(75.43,38.81) v1(75.43,38.1) v1(75.43,37.39) v1(75.43,36.68) v1(75.43,35.97) v1(75.43,35.26) v1(76.15,39.53) v1(76.15,38.81) v1(76.15,38.1) v1(76.15,37.39) v1(76.15,36.68) v1(76.15,35.97) v1(76.15,35.26) v1(76.86,39.53) v1(76.86,38.81) v1(76.86,38.1) v1(77.57,39.53) v1(77.57,38.81) v1(77.57,38.1) v1(78.28,39.53) v1(78.28,38.81) v1(78.28,38.1) v1(78.99,39.53) v1(78.99,38.81) v1(78.99,38.1) v1(79.7,39.53) v1(79.7,38.81) v1(79.7,38.1) v1(80.41,39.53) v1(80.41,38.81) v1(80.41,38.1)
VCC1V3: length 36.1
  Top Layer w0.152: U18.D16 48.06,28.99 v1(48.17,29.09)
  Top Layer w0.254: U18.H7 45.69,35.41 v1(46.18,35.9) ; U18.H7 U18.G8 47.15,34.57 47.48,34.23 v1(47.48,31.91) 47.48,31.56 U18.G13 v1(45.99,30.07) U18.H14 ; U18.H7 45.06,36 42.32,36 U18.N7 U18.P8 40.12,33.8 v1(40.12,32.16) 40.12,31.84 40.13,31.83 40.13,31.33 U18.P13 U18.N14
  Inner1 w0.254: v1(47.48,31.91) 48.23,31.16 48.23,29.15 v1(48.17,29.09) ; v1(40.12,32.16) 40.12,30.59 37.13,27.6 37.13,26.36 37.6,25.89 41.61,25.89 v1(41.82,25.68)
VCC3V3: length 159.2
  Top Layer w0.152: v1(47.75,21.12) 48.12,20.75 50.15,20.75 U6.5 ; v1(59.69,30.17) 59.79,30.17 R1.2
  Top Layer w0.508: C51.2 51.45,17.64 C52.2 52.07,19.96 v1(52.07,21.01)
  Inner1 w0.508: v1(32.49,31.55) 33.47,30.57 33.47,27.66 36.44,24.69 36.44,23.44 37.56,22.32 38.52,22.32 40.6,20.24 46.87,20.24 v1(47.75,21.12) ; 47.88,21.01 v1(52.07,21.01) 53.18,22.12 53.18,28.98 P1.2 ; 47.76,21.13 47.75,21.14
  Bottom Layer w0.152: R23.2 70.26,3.9 RN3.6 ; RN3.6 RN3.5 68.49,4.46 61.47,11.48 61.47,12.68 60.34,13.81 60.34,27.74 58.71,29.38 56.01,29.38 55.21,30.17 ; RN3.6 RN3.7 70.83,2.76 ; 55.21,30.17 54.59,30.17 P1.2 ; 55.21,30.17 55.21,30.52 55.29,30.59 59.27,30.59 v1(59.69,30.17) ; v1(32.49,31.55) 32.54,31.55 32.54,29.72 31.26,28.44 24.96,28.44 23.03,26.51 23.03,12.41 R25.1 R24.1
  Bottom Layer w0.254: v1(33.79,33.52) 33.79,39.8 31.75,41.84 31.75,50.72 27.19,55.27 27.19,57.11 27.74,57.65 29.35,57.65 30.43,58.73 U7.4
  vias: v1(29.97,31.3) v1(31.29,31.59)
VCC5V: length 174.3
  Top Layer w0.152: U1.1 28.51,26.53 29.08,25.96 29.08,25.2 28.51,24.63 U1.3 ; v1(21.94,15.51) 21.81,15.63 U12.30 ; R11.2 18.69,37.26 R8.2 ; U3.3 28.58,30.04 29.21,30.66 29.21,31.3 28.57,31.94 U3.1 ; 16.51,14.98 16.7,15.17 18.04,15.17 18.81,15.94 U12.24 ; v1(61.13,21.68) 61.22,21.6 U13.30 ; U13.24 64.22,21.6 65.58,22.97 C62.1
  Top Layer w0.254: CN3.6 81.34,36.19 81.91,35.62 v1(81.91,34.09) ; C62.1 65.69,22.96 v1(65.69,22.14) ; U4.1 28.9,36.95 v1(29.59,36.25) 29.59,35.87 28.77,35.05 U4.3 ; v1(3.68,28.66) 5.58,28.66 CN2.6 ; C61.1 16.51,14.98 v1(16.51,15.55)
  Inner1 w0.381: v1(65.69,22.14) 58.25,22.14 55,18.88 33.85,18.88 25.15,27.59 v1(25.15,29.27)
  Bottom Layer w0.152: v1(61.13,21.68) 65.24,21.68 v1(65.69,22.14) ; 20.45,15.55 20.49,15.51 v1(21.94,15.51)
  Bottom Layer w0.254: 23.83,27.95 22.72,26.84 22.72,17.83 20.45,15.55 v1(16.51,15.55) ; 23.83,27.95 4.39,27.95 v1(3.68,28.66) ; 23.83,27.95 v1(25.15,29.27) ; v1(81.91,34.09) 81.91,30.85 80.63,29.57 67.49,29.57 65.69,27.78 v1(65.69,22.14) ; U7.2 28.07,58.73 26.84,57.5 26.84,55.13 31.39,50.57 31.39,38.05 v1(29.59,36.25)
  vias: v1(23.75,36.96) v1(23.75,36.25) v1(23.75,35.54) v1(23.75,34.8) v1(23.75,34.09) v1(23.75,33.38) v1(23.75,32.64) v1(23.75,31.93) v1(24.51,31.9)
VCCSERA: length 17.2
  Top Layer w0.152: R40.2 6.87,49.46 14.99,49.46 15.37,49.84 15.37,50.97 R41.2 16.26,51.86 16.26,54.54 17.52,55.8 L7.2
VCCSERB: length 17.1
  Top Layer w0.152: L8.2 17.52,45.01 16.26,43.74 16.26,41.07 R43.2 15.37,40.18 15.37,39.05 15.12,38.8 6.73,38.8 R42.2
VCCSERC: length 17.2
  Top Layer w0.152: L9.2 66.43,53.28 67.69,54.54 67.69,57.22 R51.2 68.58,58.11 68.58,59.24 68.96,59.62 77.08,59.62 R50.2
VCCSERD: length 17.2
  Top Layer w0.152: R52.2 77.08,48.83 68.96,48.83 68.58,48.45 68.58,47.31 67.69,46.42 67.69,43.75 66.43,42.49 L10.2
VDDM: length 13.4
  Top Layer w0.152: R3.2 38.85,42.32 38.93,42.24 ; R3.2 35.7,43.83 R4.2 ; R3.2 35.66,40.77 35.66,39.52 v1(35.37,39.23) 35.33,39.27 35.11,39.27 34.9,39.06 34.9,38.16 U18.Y5
  Bottom Layer w0.152: C27.1 36.77,38.05 35.59,39.23 v1(35.37,39.23)
VSSM: length 16.8
  Top Layer w0.152: R5.2 42.05,43.73 R6.2 41.16,42.98 40,42.98 39.12,43.87 L3.1 38.25,44.54 v1(38.1,44.54) ; U18.Y4 35.61,38.25 35.56,38.25 v1(35.43,38.38)
  Bottom Layer w0.152: v1(38.1,44.54) 38.1,42.72 34.84,39.45 34.84,39.01 35.15,38.7 35.15,38.66 v1(35.43,38.38) 35.43,37.58 C27.2
(no net):
  vias: v1(58.55,33.97)
AN5: length 49.1
  Top Layer w0.152: v1(35.18,23.68) 35.56,23.3 v1(37.59,23.3) ; U18.Y9 35.96,33.77 v1(35.76,33.57)
  Bottom Layer w0.152: v1(35.18,23.68) 35.08,23.68 33.43,25.33 31.5,25.33 31.24,25.58 31.24,27.59 31.52,27.87 32.3,27.87 33.02,28.59 33.02,32.03 33.17,32.19 35.43,32.19 35.94,32.69 35.94,33.46 35.83,33.57 v1(35.76,33.57) ; v1(37.59,23.3) 38.1,22.79 38.1,21.42 39.12,20.41 39.12,20 38.76,19.64 34.4,19.64 30.56,15.8 28.15,15.8 25.79,13.44 R21.1
  Bottom Layer w0.254: C49.1 24.25,5.45 R22.2 24.27,7.04 R21.1
CSA: length 38.3
  Top Layer w0.152: v1(3.68,34.73) 3.72,34.69 CN2.2 ; v1(35.34,32.9) 35.66,32.59 35.66,31 U18.Y13
  Bottom Layer w0.152: v1(35.34,32.9) 34.88,32.44 26.29,32.44 25.22,31.37 22.19,31.37 19.88,33.68 4.73,33.68 v1(3.68,34.73)
CSB: length 34.8
  Top Layer w0.152: v1(80.39,30.16) 80.35,30.19 CN3.2 ; U18.A10 51.29,32.84 v1(52.07,32.06)
  Bottom Layer w0.152: v1(80.39,30.16) 81.03,30.79 81.03,32.06 80.77,32.31 56.9,32.31 56.26,31.68 52.45,31.68 v1(52.07,32.06)
GHA: length 12.4
  Top Layer w0.381: Q3.3 10.67,23.81 v1(10.8,23.81) ; U12.6 19.31,23.25 v1(18.76,23.8)
  Bottom Layer w0.381: v1(18.76,23.8) 18.76,23.07 17.73,22.04 12.56,22.04 v1(10.8,23.81)
GHB: length 7.1
  Top Layer w0.381: v1(10.61,19.34) 10.61,19.17 Q5.3 ; U12.15 15.49,19.44 v1(14.95,19.98)
  Bottom Layer w0.381: v1(14.95,19.98) 11.26,19.98 v1(10.61,19.34)
